# EAGLE design mcat-4cu-b-v2 (EAGLE 6.5.0)

## Sheet 1 of 5
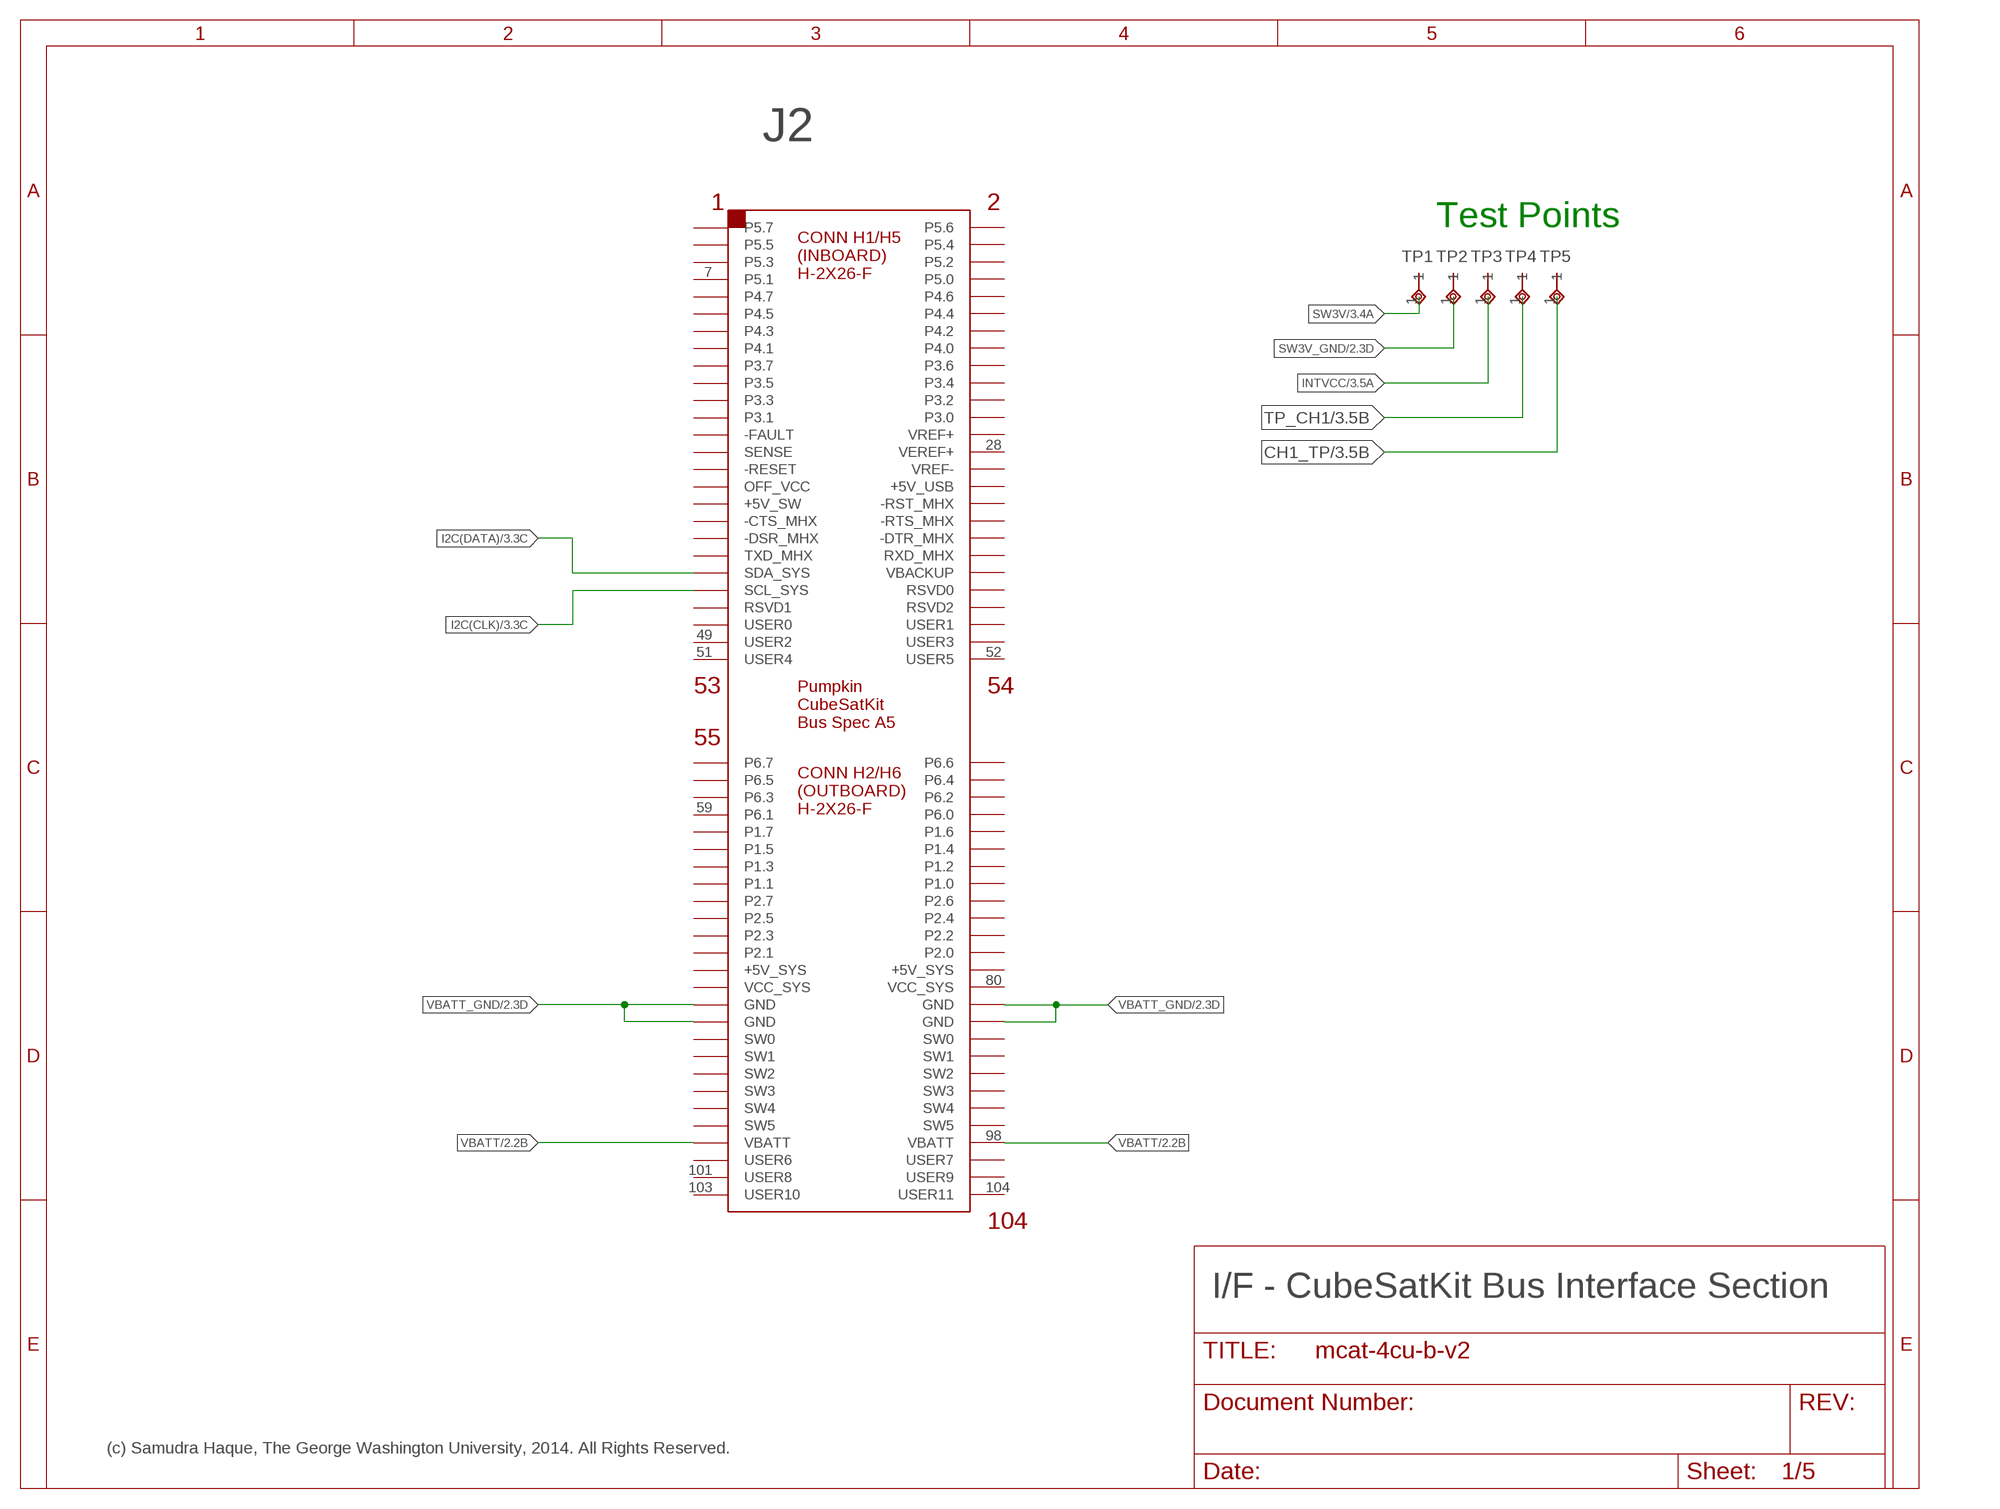
[diagram p0: schematic, sheet 1]

### Parts
J2  CSK-BUS-CONN2X2X26  [CSK-BUS-PKG]
TP1  1P-1508-0-57-15-00-00-03-0  [1P-TP-MILLMAX-11]
TP2  1P-1508-0-57-15-00-00-03-0  [1P-TP-MILLMAX-11]
TP3  1P-1508-0-57-15-00-00-03-0  [1P-TP-MILLMAX-11]
TP4  1P-1508-0-57-15-00-00-03-0  [1P-TP-MILLMAX-11]
TP5  1P-1508-0-57-15-00-00-03-0  [1P-TP-MILLMAX-11]

### Nets
CH1_TP: TP5.1 ; also sheet 3,5
I2C(CLK): J2.43(SCL_SYS) ; also sheet 3
I2C(DATA): J2.41(SDA_SYS) ; also sheet 3
INTVCC: TP3.1 ; also sheet 2,3
SW3V: TP1.1 ; also sheet 3
SW3V_GND: TP2.1 ; also sheet 2,3
TP_CH1: TP4.1 ; also sheet 3
VBATT: J2.97(VBATT) J2.98(VBATT) ; also sheet 2
VBATT_GND: J2.81(GND) J2.82(GND) J2.83(GND) J2.84(GND) ; also sheet 2
Unconnected: J2.1(P5.7) J2.2(P5.6) J2.3(P5.5) J2.4(P5.4) J2.5(P5.3) J2.6(P5.2) J2.7(P5.1) J2.8(P5.0) J2.9(P4.7) J2.10(P4.6) J2.11(P4.5) J2.12(P4.4) J2.13(P4.3) J2.14(P4.2) J2.15(P4.1) J2.16(P4.0) J2.17(P3.7) J2.18(P3.6) J2.19(P3.5) J2.20(P3.4) J2.21(P3.3) J2.22(P3.2) J2.23(P3.1) J2.24(P3.0) J2.25(-FAULT) J2.26(VREF+) J2.27(SENSE) J2.28(VEREF+) J2.29(-RESET) J2.30(VREF-) J2.31(OFF_VCC) J2.32(+5V_USB) J2.33(+5V_SW) J2.34(-RST_MHX) J2.35(-CTS_MHX) J2.36(-RTS_MHX) J2.37(-DSR_MHX) J2.38(-DTR_MHX) J2.39(TXD_MHX) J2.40(RXD_MHX) J2.42(VBACKUP) J2.44(RSVD0) J2.45(RSVD1) J2.46(RSVD2) J2.47(USER0) J2.48(USER1) J2.49(USER2) J2.50(USER3) J2.51(USER4) J2.52(USER5) J2.53(P6.7) J2.54(P6.6) J2.55(P6.5) J2.56(P6.4) J2.57(P6.3) J2.58(P6.2) J2.59(P6.1) J2.60(P6.0) J2.61(P1.7) J2.62(P1.6) J2.63(P1.5) J2.64(P1.4) J2.65(P1.3) J2.66(P1.2) J2.67(P1.1) J2.68(P1.0) J2.69(P2.7) J2.70(P2.6) J2.71(P2.5) J2.72(P2.4) J2.73(P2.3) J2.74(P2.2) J2.75(P2.1) J2.76(P2.0) J2.77(+5V_SYS) J2.78(+5V_SYS) J2.79(VCC_SYS) J2.80(VCC_SYS) J2.85(SW0) J2.86(SW0) J2.87(SW1) J2.88(SW1) J2.89(SW2) J2.90(SW2) J2.91(SW3) J2.92(SW3) J2.93(SW4) J2.94(SW4) J2.95(SW5) J2.96(SW5) J2.99(USER6) J2.100(USER7) J2.101(USER8) J2.102(USER9) J2.103(USER10) J2.104(USER11)

### Notes on the sheet
- Test Points
- I/F - CubeSatKit Bus Interface Section
- (c) Samudra Haque, The George Washington University, 2014. All Rights Reserved.

## Sheet 2 of 5
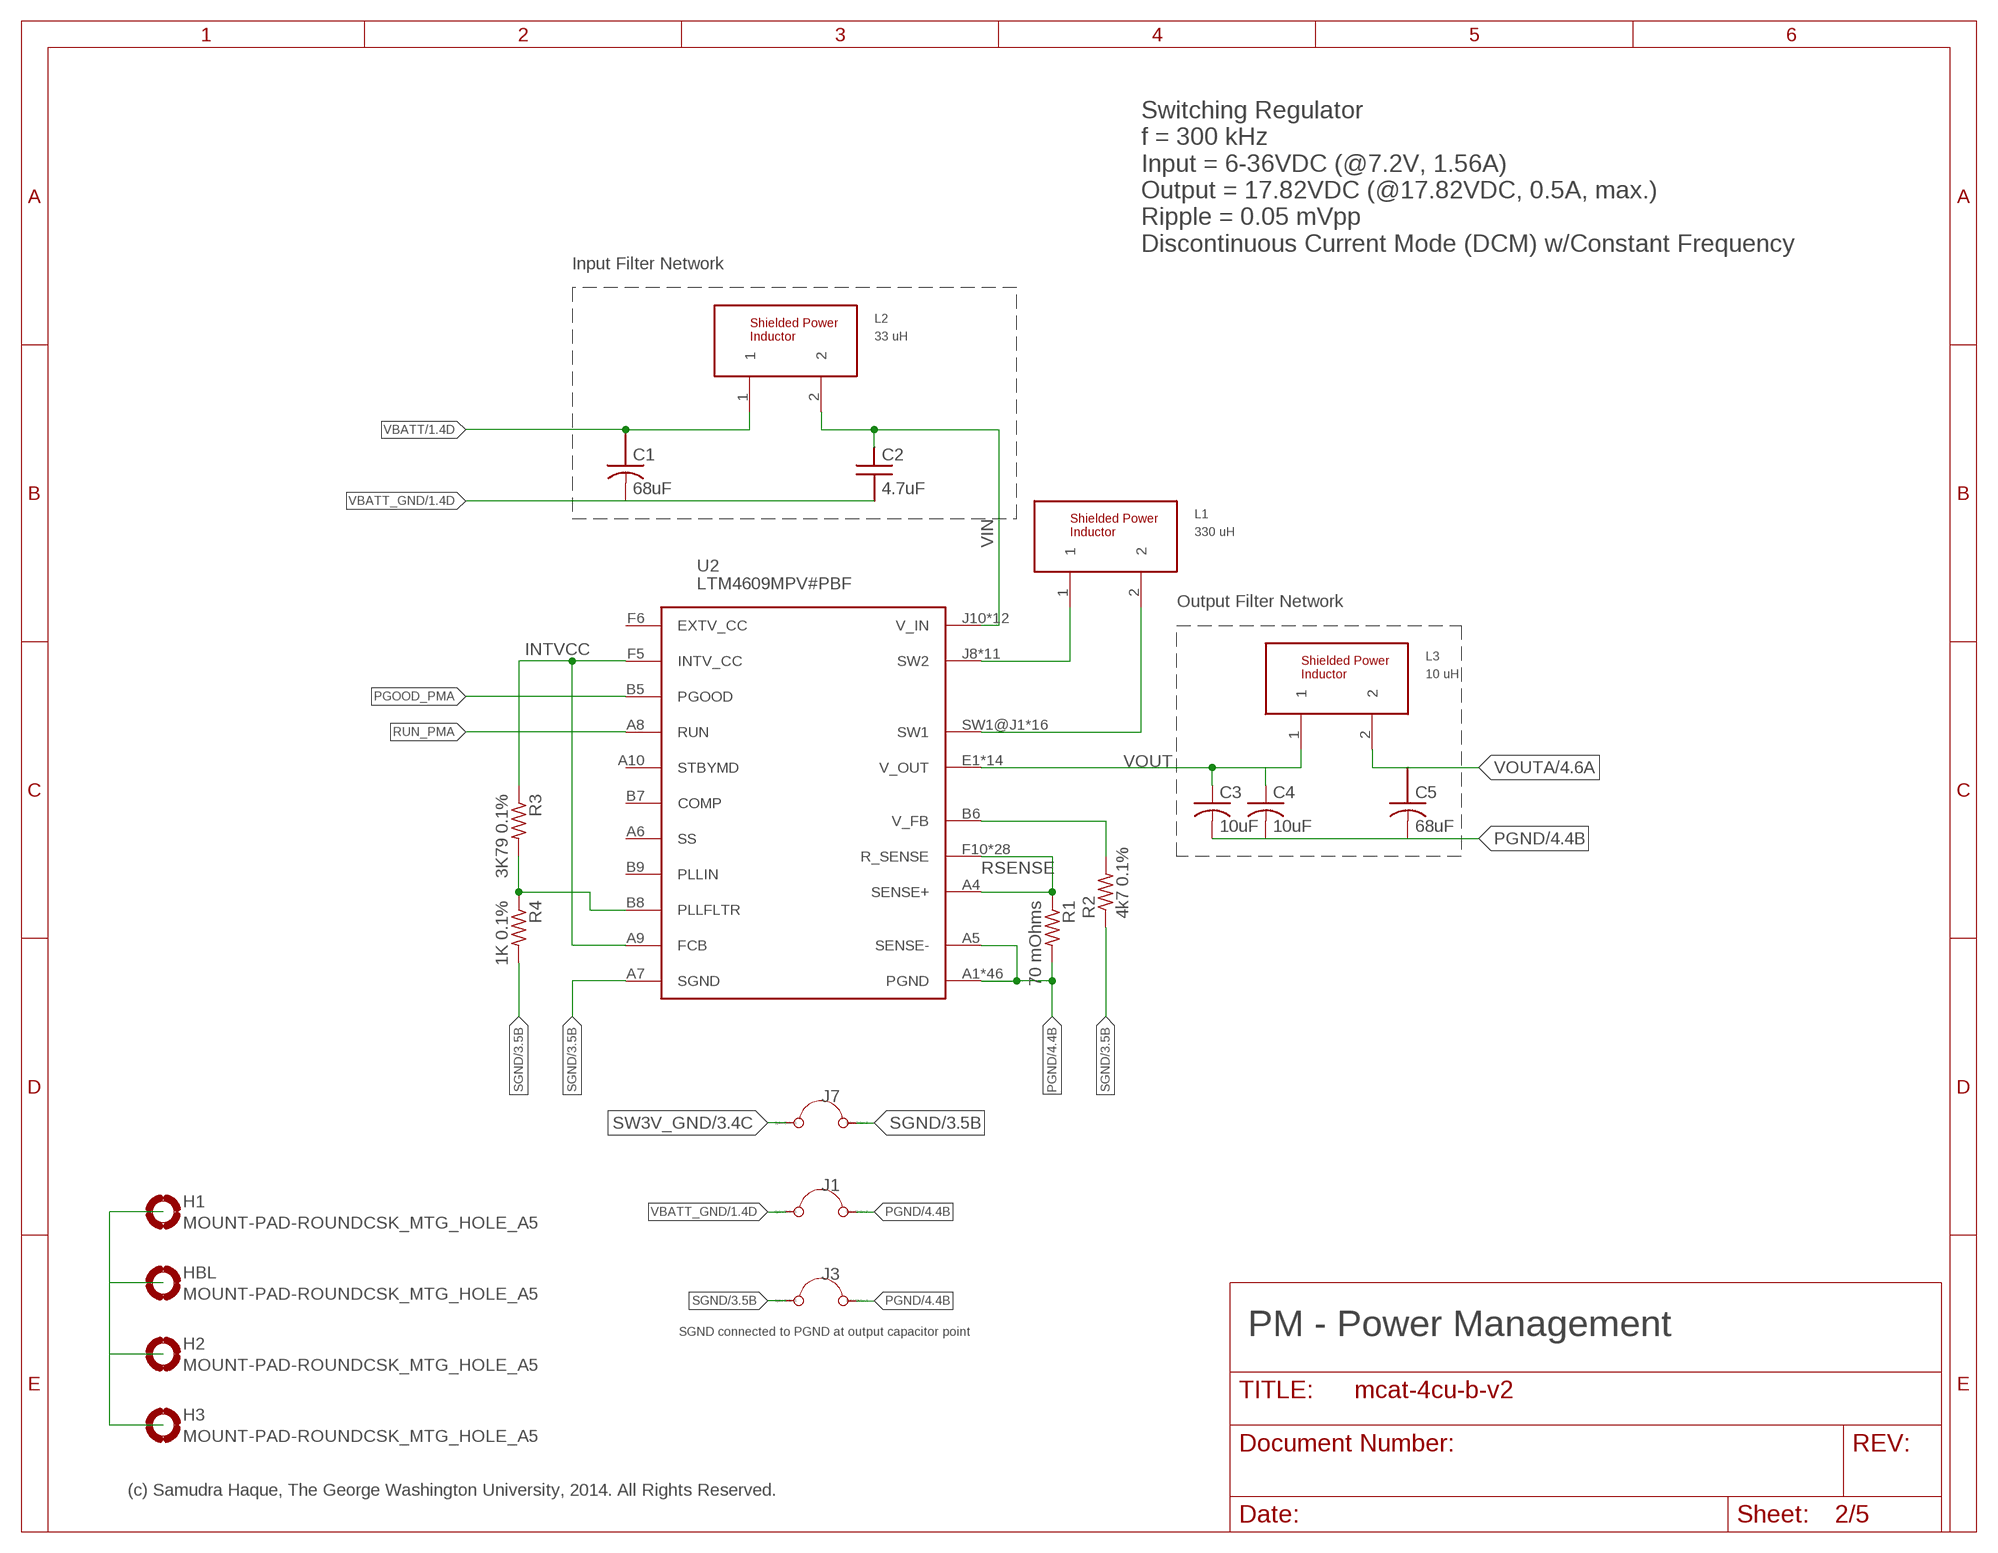
[diagram p1: schematic, sheet 2]

### Parts
C1  68uF  OSCON-50SVPF68M  [OS-CON-SVPF-F12]
C2  4.7uF  AVX-LD105C475KAB2A  [MLCC-X7R-1210]
C3  10uF  C-USC1210K  [C1210K]
C4  10uF  C-USC1210K  [C1210K]
C5  68uF  OSCON-50SVPF68M  [OS-CON-SVPF-F12]
H1  MOUNT-PAD-ROUNDCSK_MTG_HOLE_A5  [CSK_MOUNTING_HOLE]
H2  MOUNT-PAD-ROUNDCSK_MTG_HOLE_A5  [CSK_MOUNTING_HOLE]
H3  MOUNT-PAD-ROUNDCSK_MTG_HOLE_A5  [CSK_MOUNTING_HOLE]
HBL  MOUNT-PAD-ROUNDCSK_MTG_HOLE_A5  [CSK_MOUNTING_HOLE]
J1  JUMPER  [05]
J3  JUMPER  [05]
J7  JUMPER  [05]
L1  330 uH  MSS1048-334KL_  [MSS1048]
L2  33 uH  MSS1038-333ML_  [MSS1048]
L3  10 uH  ELL-5PS100M  [SERIES-POWER-INDUCTORS]
R1  70 mOhms  R-US_R1206  [R1206]
R2  4k7 0.1%  R-US_R0603  [R0603]
R3  3K79 0.1%  R-US_R0805  [R0805]
R4  1K 0.1%  R-US_R0805  [R0805]
U2  LTM4609MPV#PBF  LTM4609MPV#PBFROHS/HITEMP  [LGA-141-LTC-05-08-1840-B]

### Nets
INTVCC: R3.1 U2.A9(FCB) U2.F5(INTV_CC) ; also sheet 1,3
N$8: R2.2 U2.B6(V_FB)
N$21: H1.P$1(MOUNT) H2.P$1(MOUNT) H3.P$1(MOUNT) HBL.P$1(MOUNT)
PGND: C3.2 C4.2 C5.K1(K) J1.2(-) J3.2(-) R1.2 U2.A1(PGND) U2.A2(PGND) U2.A3(PGND) U2.A5(SENSE-) U2.A11(PGND) U2.A12(PGND) U2.B1(PGND) U2.B2(PGND) U2.B3(PGND) U2.B4(PGND) U2.B10(PGND) U2.B11(PGND) U2.B12(PGND) U2.C1(PGND) U2.C2(PGND) U2.C3(PGND) U2.C4(PGND) U2.C5(PGND) U2.C6(PGND) U2.C7(PGND) U2.C8(PGND) U2.C9(PGND) U2.C10(PGND) U2.C11(PGND) U2.C12(PGND) U2.D1(PGND) U2.D2(PGND) U2.D3(PGND) U2.D4(PGND) U2.D5(PGND) U2.D6(PGND) U2.D7(PGND) U2.D8(PGND) U2.D9(PGND) U2.D10(PGND) U2.D11(PGND) U2.D12(PGND) U2.E3(PGND) U2.E4(PGND) U2.E5(PGND) U2.E6(PGND) U2.E7(PGND) U2.E8(PGND) U2.E9(PGND) U2.E10(PGND) U2.E11(PGND) U2.E12(PGND) ; also sheet 4,5
PGOOD_PMA: U2.B5(PGOOD)
RSENSE: R1.1 U2.A4(SENSE+) U2.F10(R_SENSE) U2.F11(R_SENSE) U2.F12(R_SENSE) U2.G5(R_SENSE) U2.G6(R_SENSE) U2.G7(R_SENSE) U2.G8(R_SENSE) U2.G9(R_SENSE) U2.G10(R_SENSE) U2.G11(R_SENSE) U2.G12(R_SENSE) U2.H5(R_SENSE) U2.H6(R_SENSE) U2.H7(R_SENSE) U2.H8(R_SENSE) U2.H9(R_SENSE) U2.H10(R_SENSE) U2.H11(R_SENSE) U2.H12(R_SENSE) U2.J5(R_SENSE) U2.J6(R_SENSE) U2.J7(R_SENSE) U2.K5(R_SENSE) U2.K6(R_SENSE) U2.L5(R_SENSE) U2.L6(R_SENSE) U2.M5(R_SENSE) U2.M6(R_SENSE)
RUN_PMA: U2.A8(RUN)
SETFREQ: R3.2 R4.1 U2.B8(PLLFLTR)
SGND: J3.1(+) J7.2(-) R2.1 R4.2 U2.A7(SGND) ; also sheet 3,4,5
SW1: L1.2 U2.SW1@J1(SW1) U2.SW1@J2(SW1) U2.SW1@J3(SW1) U2.SW1@J4(SW1) U2.SW1@K1(SW1) U2.SW1@K2(SW1) U2.SW1@K3(SW1) U2.SW1@K4(SW1) U2.SW1@L1(SW1) U2.SW1@L2(SW1) U2.SW1@L3(SW1) U2.SW1@L4(SW1) U2.SW1@M1(SW1) U2.SW1@M2(SW1) U2.SW1@M3(SW1) U2.SW1@M4(SW1)
SW2: L1.1 U2.J8(SW2) U2.J9(SW2) U2.K7(SW2) U2.K8(SW2) U2.K9(SW2) U2.L7(SW2) U2.L8(SW2) U2.L9(SW2) U2.M7(SW2) U2.M8(SW2) U2.M9(SW2)
SW3V_GND: J7.1(+) ; also sheet 1,3
VBATT: C1.A1(A) L2.1 ; also sheet 1
VBATT_GND: C1.K1(K) C2.2 J1.1(+) ; also sheet 1
VIN: C2.1 L2.2 U2.J10(V_IN) U2.J11(V_IN) U2.J12(V_IN) U2.K10(V_IN) U2.K11(V_IN) U2.K12(V_IN) U2.L10(V_IN) U2.L11(V_IN) U2.L12(V_IN) U2.M10(V_IN) U2.M11(V_IN) U2.M12(V_IN)
VOUT: C3.1 C4.1 L3.1 U2.E1(V_OUT) U2.E2(V_OUT) U2.F1(V_OUT) U2.F2(V_OUT) U2.F3(V_OUT) U2.F4(V_OUT) U2.G1(V_OUT) U2.G2(V_OUT) U2.G3(V_OUT) U2.G4(V_OUT) U2.H2(V_OUT) U2.H3(V_OUT) U2.H4(V_OUT) U2.VOUT(V_OUT)
VOUTA: C5.A1(A) L3.2 ; also sheet 4
Unconnected: U2.A6(SS) U2.A10(STBYMD) U2.B7(COMP) U2.B9(PLLIN) U2.F6(EXTV_CC)

### Notes on the sheet
- Switching Regulator
  f = 300 kHz
  Input = 6-36VDC (@7.2V, 1.56A)
  Output = 17.82VDC (@17.82VDC, 0.5A, max.)
  Ripple = 0.05 mVpp
  Discontinuous Current Mode (DCM) w/Constant Frequency
- Input Filter Network
- Output Filter Network
- SGND connected to PGND at output capacitor point | PM - Power Management
- (c) Samudra Haque, The George Washington University, 2014. All Rights Reserved.

## Sheet 3 of 5
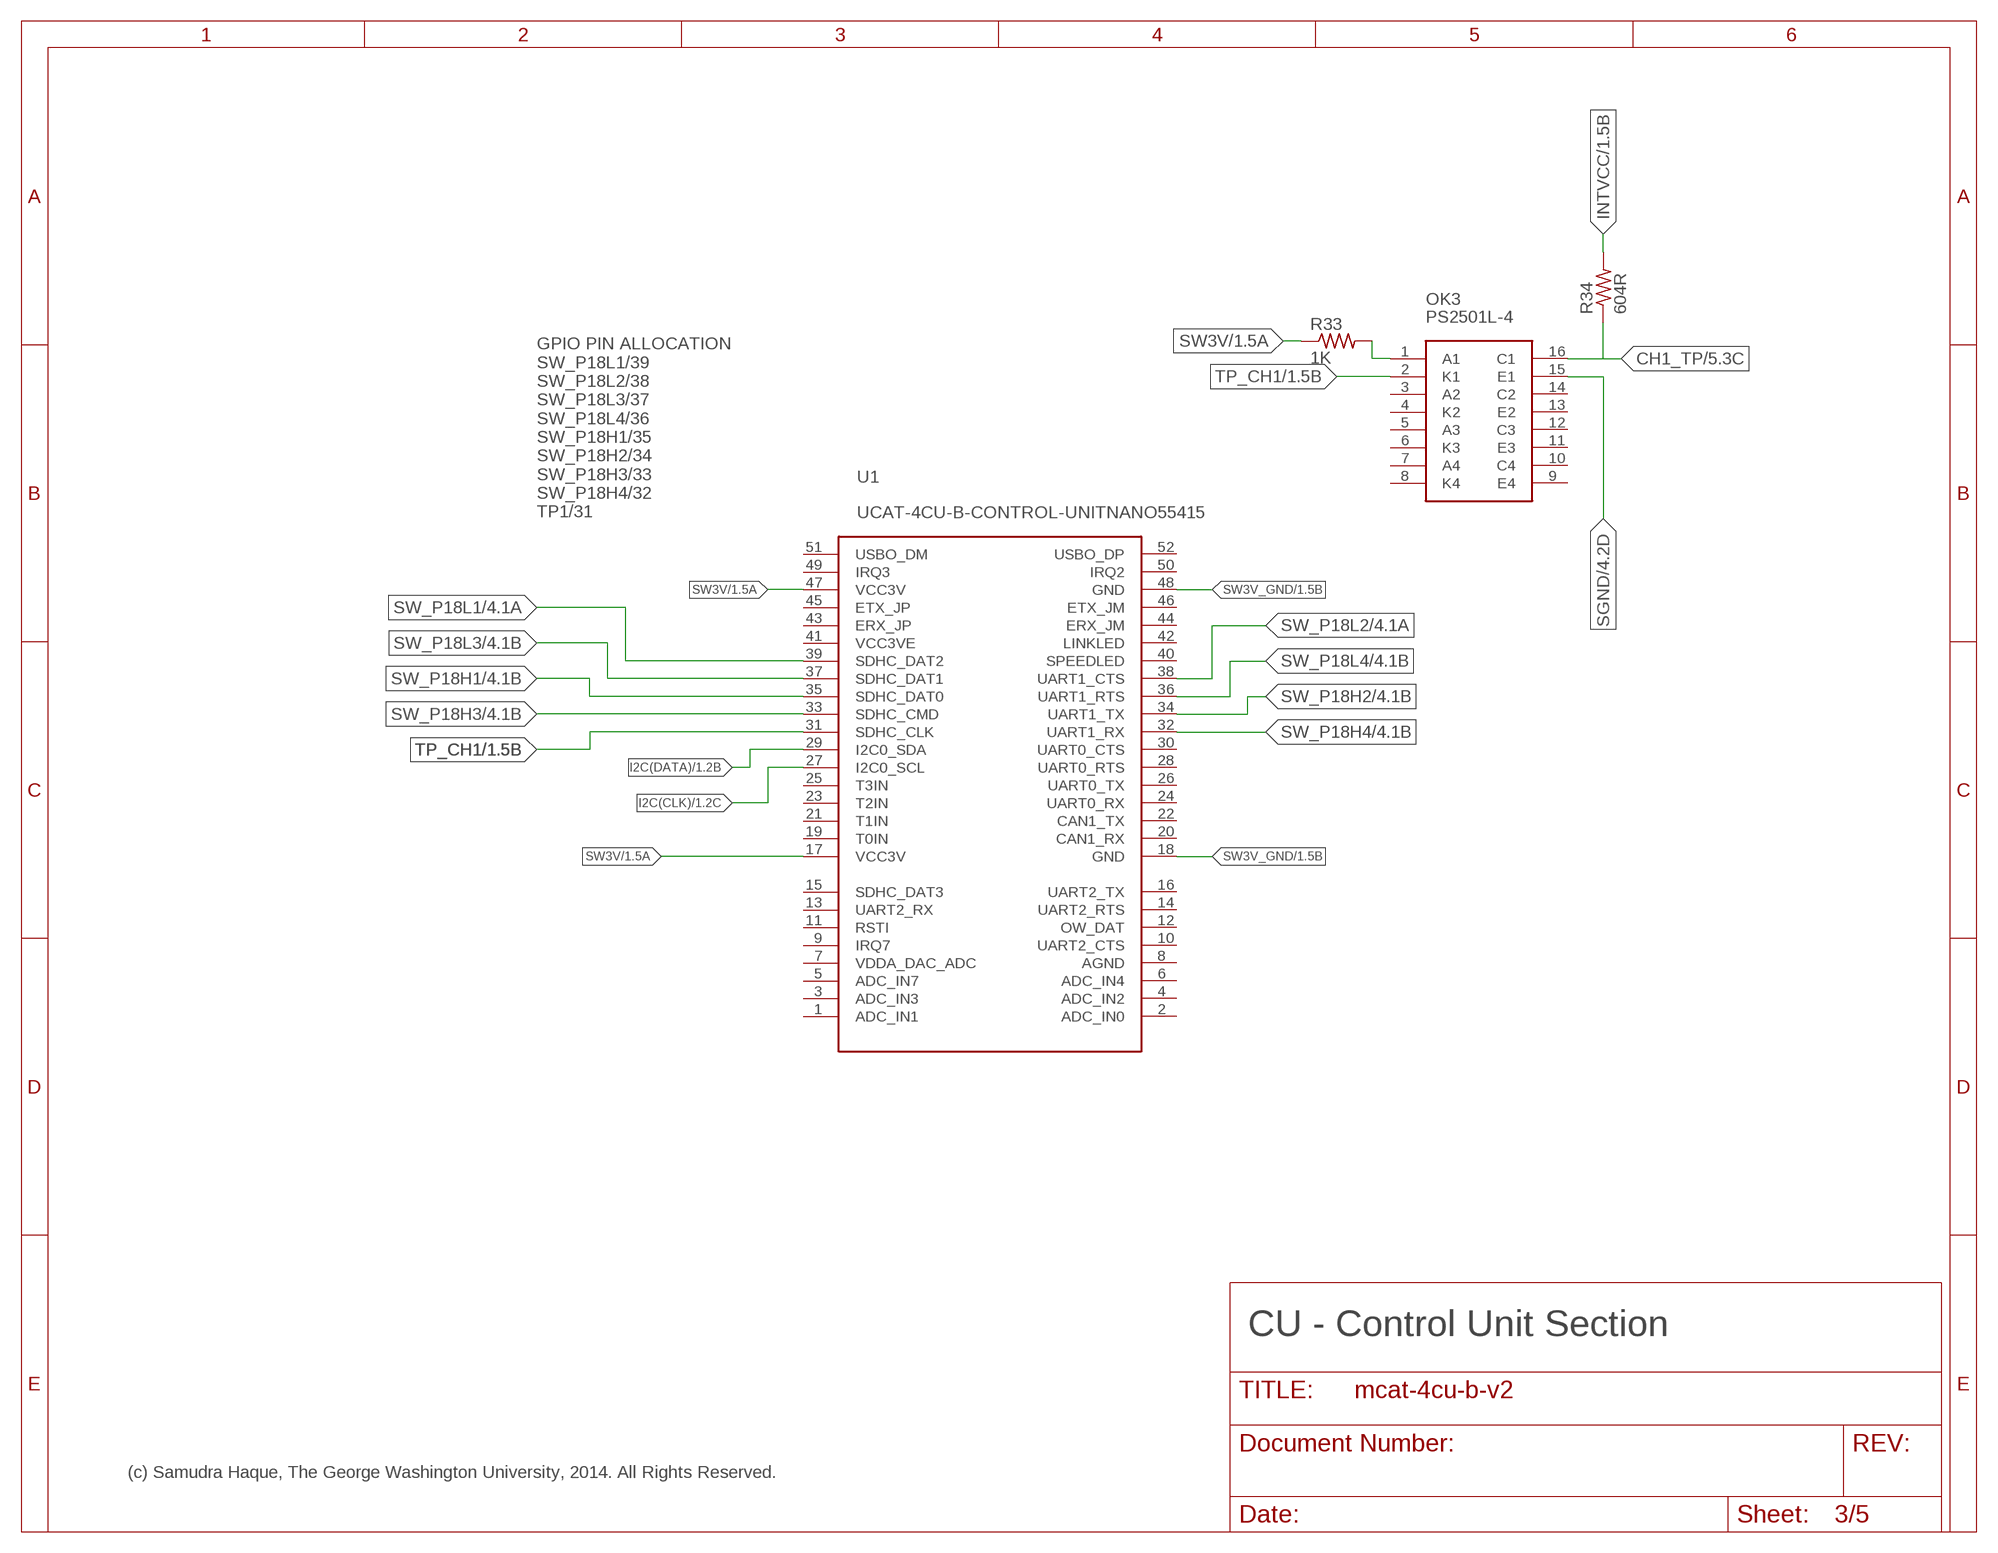
[diagram p2: schematic, sheet 3]

### Parts
OK3  PS2501L-4  [PS2501L-4]
R33  1K  R-US_R0805  [R0805]
R34  604R  R-US_R0805  [R0805]
U1  UCAT-4CU-B-CONTROL-UNITNANO55415  [MOLEX-MINI-PCI-EXPRESS-8MM-52CKT]

### Nets
CH1_TP: OK3.16(C1) R34.1 ; also sheet 1,5
I2C(CLK): U1.27(I2C0_SCL) ; also sheet 1
I2C(DATA): U1.29(I2C0_SDA) ; also sheet 1
INTVCC: R34.2 ; also sheet 1,2
N$3: U1.18(GND)
N$16: OK3.1(A1) R33.2
SGND: OK3.15(E1) ; also sheet 2,4,5
SW3V: R33.1 U1.17(VCC3V) U1.47(VCC3V) ; also sheet 1
SW3V_GND: U1.48(GND) ; also sheet 1,2
SW_P18H1: U1.35(SDHC_DAT0) ; also sheet 4
SW_P18H2: U1.34(UART1_TX) ; also sheet 4
SW_P18H3: U1.33(SDHC_CMD) ; also sheet 4
SW_P18H4: U1.32(UART1_RX) ; also sheet 4
SW_P18L1: U1.39(SDHC_DAT2) ; also sheet 4
SW_P18L2: U1.38(UART1_CTS) ; also sheet 4
SW_P18L3: U1.37(SDHC_DAT1) ; also sheet 4
SW_P18L4: U1.36(UART1_RTS) ; also sheet 4
TP_CH1: OK3.2(K1) U1.31(SDHC_CLK) ; also sheet 1
Unconnected: OK3.3(A2) OK3.4(K2) OK3.5(A3) OK3.6(K3) OK3.7(A4) OK3.8(K4) OK3.9(E4) OK3.10(C4) OK3.11(E3) OK3.12(C3) OK3.13(E2) OK3.14(C2) U1.1(ADC_IN1) U1.2(ADC_IN0) U1.3(ADC_IN3) U1.4(ADC_IN2) U1.5(ADC_IN7) U1.6(ADC_IN4) U1.7(VDDA_DAC_ADC) U1.8(AGND) U1.9(IRQ7) U1.10(UART2_CTS) U1.11(RSTI) U1.12(OW_DAT) U1.13(UART2_RX) U1.14(UART2_RTS) U1.15(SDHC_DAT3) U1.16(UART2_TX) U1.19(T0IN) U1.20(CAN1_RX) U1.21(T1IN) U1.22(CAN1_TX) U1.23(T2IN) U1.24(UART0_RX) U1.25(T3IN) U1.26(UART0_TX) U1.28(UART0_RTS) U1.30(UART0_CTS) U1.40(SPEEDLED) U1.41(VCC3VE) U1.42(LINKLED) U1.43(ERX_JP) U1.44(ERX_JM) U1.45(ETX_JP) U1.46(ETX_JM) U1.49(IRQ3) U1.50(IRQ2) U1.51(USBO_DM) U1.52(USBO_DP)

### Notes on the sheet
- GPIO PIN ALLOCATION
  SW_P18L1/39
  SW_P18L2/38
  SW_P18L3/37
  SW_P18L4/36
  SW_P18H1/35
  SW_P18H2/34
  SW_P18H3/33
  SW_P18H4/32
  TP1/31
- CU - Control Unit Section
- (c) Samudra Haque, The George Washington University, 2014. All Rights Reserved.

## Sheet 4 of 5
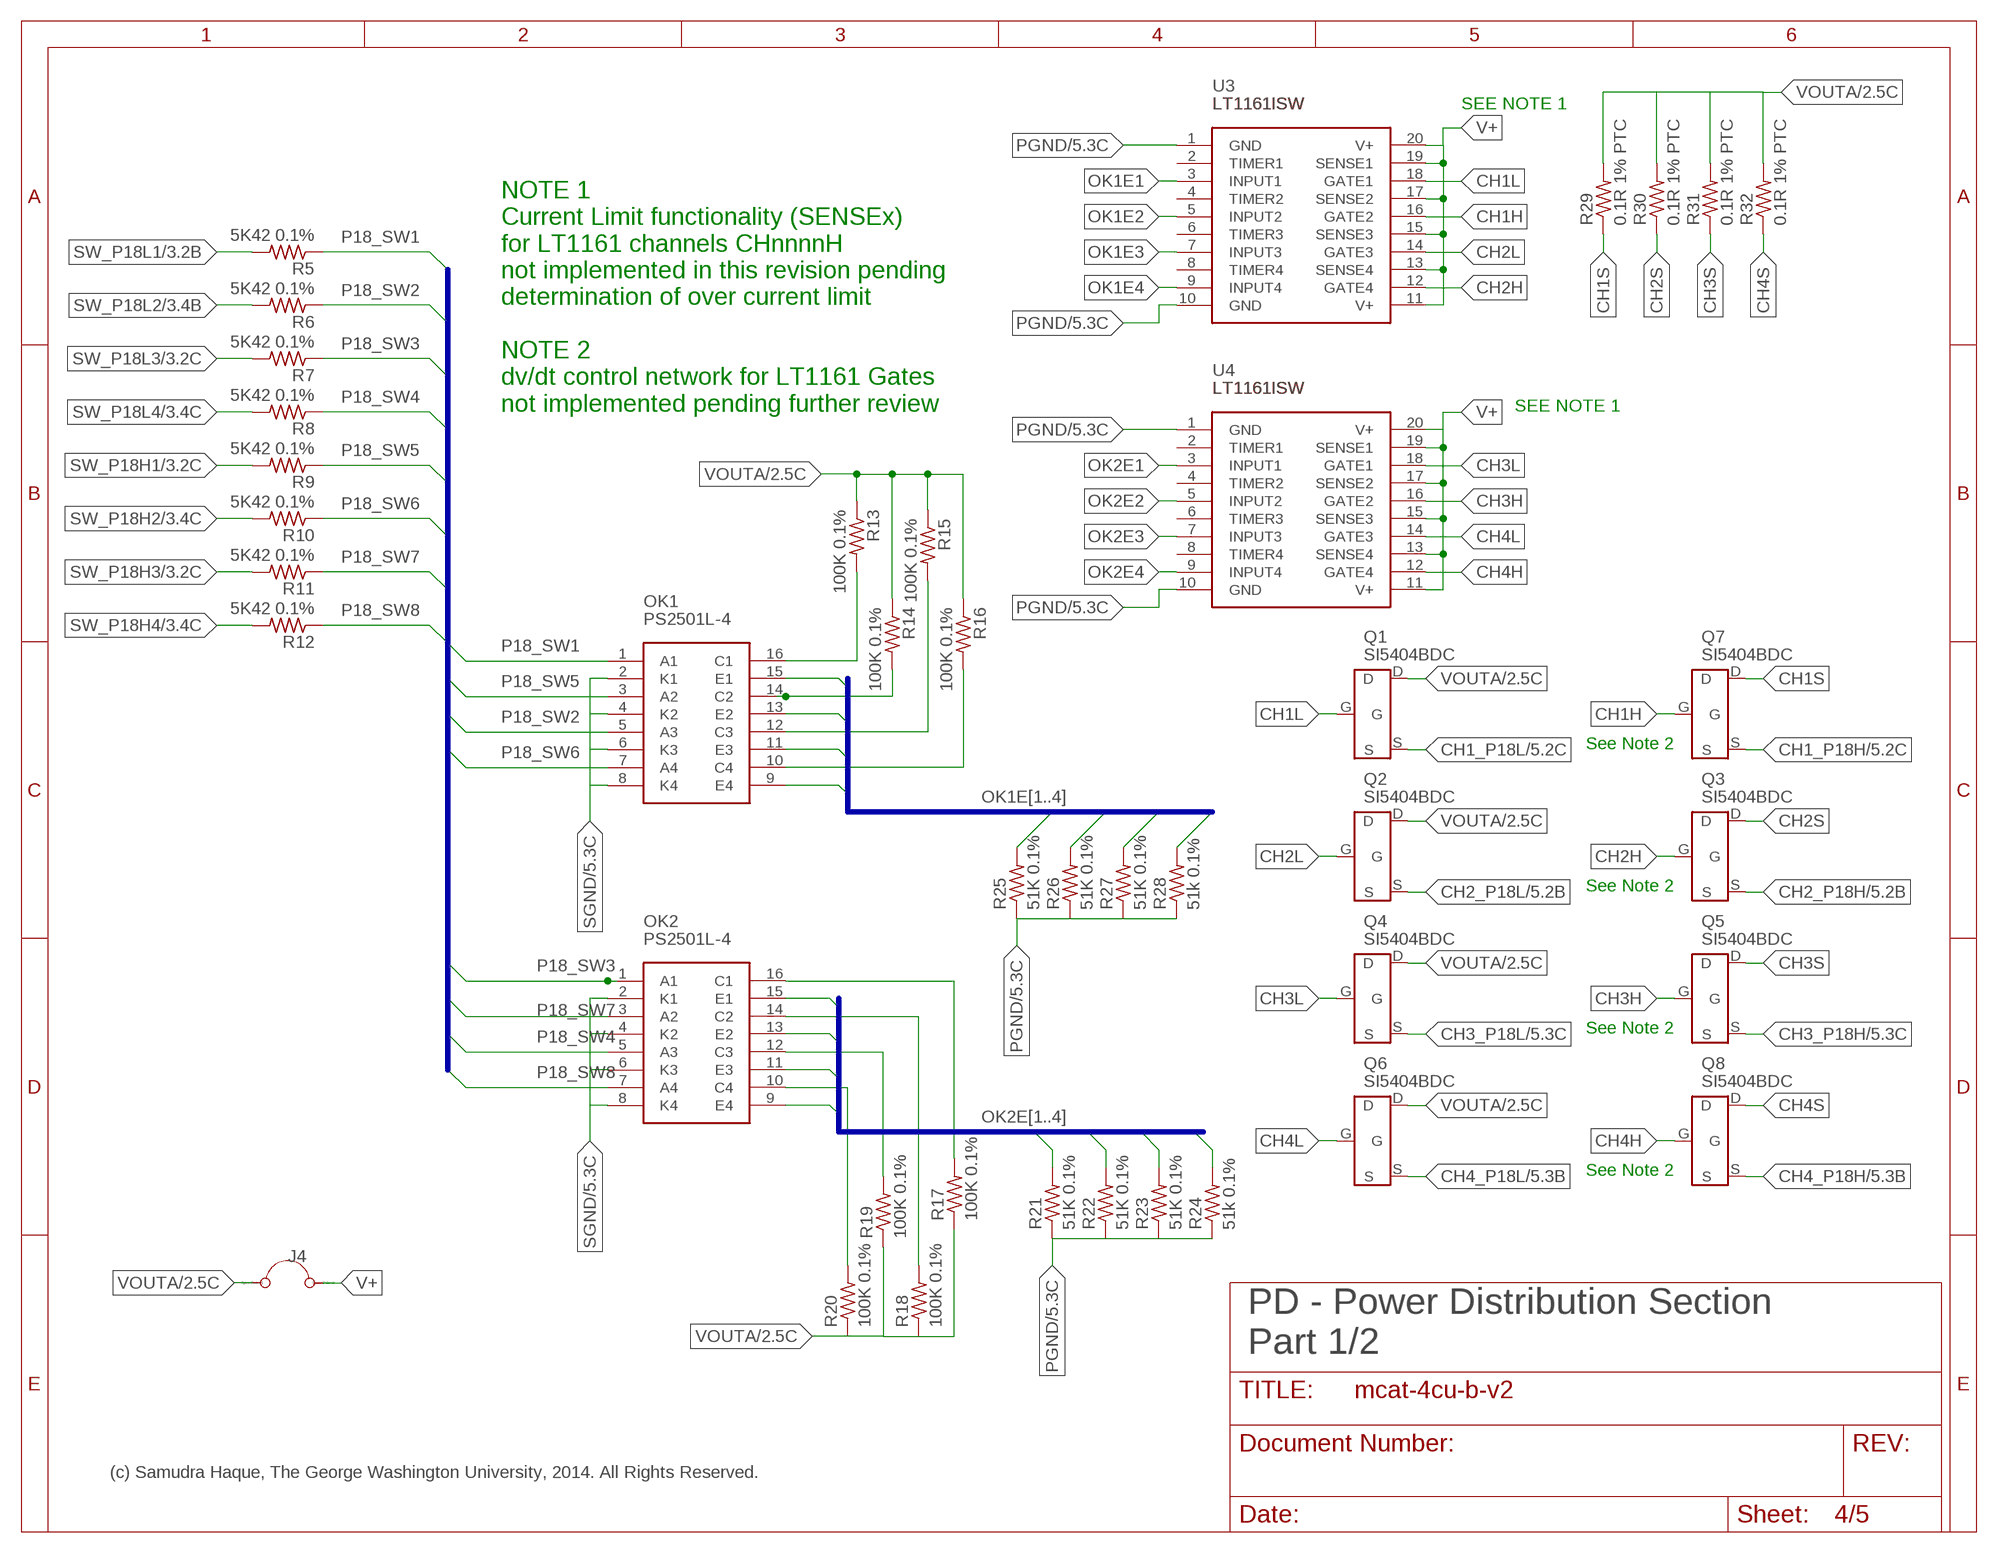
[diagram p3: schematic, sheet 4]

### Parts
J4  JUMPER  [05]
OK1  PS2501L-4  [PS2501L-4]
OK2  PS2501L-4  [PS2501L-4]
Q1  SI5404BDC  [1206-8-CHIPFET]
Q2  SI5404BDC  [1206-8-CHIPFET]
Q3  SI5404BDC  [1206-8-CHIPFET]
Q4  SI5404BDC  [1206-8-CHIPFET]
Q5  SI5404BDC  [1206-8-CHIPFET]
Q6  SI5404BDC  [1206-8-CHIPFET]
Q7  SI5404BDC  [1206-8-CHIPFET]
Q8  SI5404BDC  [1206-8-CHIPFET]
R5  5K42 0.1%  R-US_R1206  [R1206]
R6  5K42 0.1%  R-US_R1206  [R1206]
R7  5K42 0.1%  R-US_R1206  [R1206]
R8  5K42 0.1%  R-US_R1206  [R1206]
R9  5K42 0.1%  R-US_R1206  [R1206]
R10  5K42 0.1%  R-US_R1206  [R1206]
R11  5K42 0.1%  R-US_R1206  [R1206]
R12  5K42 0.1%  R-US_R1206  [R1206]
R13  100K 0.1%  R-US_R0402  [R0402]
R14  100K 0.1%  R-US_R0402  [R0402]
R15  100K 0.1%  R-US_R0402  [R0402]
R16  100K 0.1%  R-US_R0402  [R0402]
R17  100K 0.1%  R-US_R0402  [R0402]
R18  100K 0.1%  R-US_R0402  [R0402]
R19  100K 0.1%  R-US_R0402  [R0402]
R20  100K 0.1%  R-US_R0402  [R0402]
R21  51K 0.1%  R-US_R0603  [R0603]
R22  51K 0.1%  R-US_R0603  [R0603]
R23  51K 0.1%  R-US_R0603  [R0603]
R24  51k 0.1%  R-US_R0603  [R0603]
R25  51K 0.1%  R-US_R0603  [R0603]
R26  51K 0.1%  R-US_R0603  [R0603]
R27  51K 0.1%  R-US_R0603  [R0603]
R28  51k 0.1%  R-US_R0603  [R0603]
R29  0.1R 1% PTC  R-US_R0402  [R0402]
R30  0.1R 1% PTC  R-US_R0402  [R0402]
R31  0.1R 1% PTC  R-US_R0402  [R0402]
R32  0.1R 1% PTC  R-US_R0402  [R0402]
U3  LT1161ISW  [20-LEAD-PLASTIC-SO]
U4  LT1161ISW  [20-LEAD-PLASTIC-SO]

### Nets
CH1_P18H: Q7.S ; also sheet 5
CH1_P18L: Q1.S ; also sheet 5
CH1H: Q7.G U3.16(GATE2)
CH1L: Q1.G U3.18(GATE1)
CH1S: Q7.D R29.1
CH2_P18H: Q3.S ; also sheet 5
CH2_P18L: Q2.S ; also sheet 5
CH2H: Q3.G U3.12(GATE4)
CH2L: Q2.G U3.14(GATE3)
CH2S: Q3.D R30.1
CH3_P18H: Q5.S ; also sheet 5
CH3_P18L: Q4.S ; also sheet 5
CH3H: Q5.G U4.16(GATE2)
CH3L: Q4.G U4.18(GATE1)
CH3S: Q5.D R31.1
CH4_P18H: Q8.S ; also sheet 5
CH4_P18L: Q6.S ; also sheet 5
CH4H: Q8.G U4.12(GATE4)
CH4L: Q6.G U4.14(GATE3)
CH4S: Q8.D R32.1
N$4: OK1.16(C1) R13.2
N$5: OK1.14(C2) R14.2
N$7: OK1.12(C3) R15.2
N$9: OK1.10(C4) R16.2
N$10: OK2.16(C1) R17.2
N$11: OK2.14(C2) R18.2
N$12: OK2.12(C3) R19.2
N$13: OK2.10(C4) R20.2
OK1E1: OK1.15(E1) R25.2 U3.3(INPUT1)
OK1E2: OK1.13(E2) R26.2 U3.5(INPUT2)
OK1E3: OK1.11(E3) R27.2 U3.7(INPUT3)
OK1E4: OK1.9(E4) R28.2 U3.9(INPUT4)
OK2E1: OK2.15(E1) R21.2 U4.3(INPUT1)
OK2E2: OK2.13(E2) R22.2 U4.5(INPUT2)
OK2E3: OK2.11(E3) R23.2 U4.7(INPUT3)
OK2E4: OK2.9(E4) R24.2 U4.9(INPUT4)
P18_SW1: OK1.1(A1) R5.1
P18_SW2: OK1.5(A3) R6.1
P18_SW3: OK2.1(A1) R7.1
P18_SW4: OK2.5(A3) R8.1
P18_SW5: OK1.3(A2) R9.1
P18_SW6: OK1.7(A4) R10.1
P18_SW7: OK2.3(A2) R11.1
P18_SW8: OK2.7(A4) R12.1
PGND: R21.1 R22.1 R23.1 R24.1 R25.1 R26.1 R27.1 R28.1 U3.1(GND) U3.10(GND) U4.1(GND) U4.10(GND) ; also sheet 2,5
SGND: OK1.2(K1) OK1.4(K2) OK1.6(K3) OK1.8(K4) OK2.2(K1) OK2.4(K2) OK2.6(K3) OK2.8(K4) ; also sheet 2,3,5
SW_P18H1: R9.2 ; also sheet 3
SW_P18H2: R10.2 ; also sheet 3
SW_P18H3: R11.2 ; also sheet 3
SW_P18H4: R12.2 ; also sheet 3
SW_P18L1: R5.2 ; also sheet 3
SW_P18L2: R6.2 ; also sheet 3
SW_P18L3: R7.2 ; also sheet 3
SW_P18L4: R8.2 ; also sheet 3
V+: J4.2(-) U3.11(V+) U3.13(SENSE4) U3.15(SENSE3) U3.17(SENSE2) U3.19(SENSE1) U3.20(V+) U4.11(V+) U4.13(SENSE4) U4.15(SENSE3) U4.17(SENSE2) U4.19(SENSE1) U4.20(V+)
VOUTA: J4.1(+) Q1.D Q2.D Q4.D Q6.D R13.1 R14.1 R15.1 R16.1 R17.1 R18.1 R19.1 R20.1 R29.2 R30.2 R31.2 R32.2 ; also sheet 2
Unconnected: U3.2(TIMER1) U3.4(TIMER2) U3.6(TIMER3) U3.8(TIMER4) U4.2(TIMER1) U4.4(TIMER2) U4.6(TIMER3) U4.8(TIMER4)

### Buses
P18_SW[1..8]
OK1E[1..4]
OK2E[1..4]

### Notes on the sheet
- SEE NOTE 1
- NOTE 1 
  Current Limit functionality (SENSEx)
  for LT1161 channels CHnnnnH
  not implemented in this revision pending
  determination of over current limit
  
  NOTE 2
  dv/dt control network for LT1161 Gates
  not implemented pending further review
- SEE NOTE 1
- See Note 2
- See Note 2
- See Note 2
- See Note 2
- PD - Power Distribution Section
  Part 1/2
- (c) Samudra Haque, The George Washington University, 2014. All Rights Reserved.

## Sheet 5 of 5
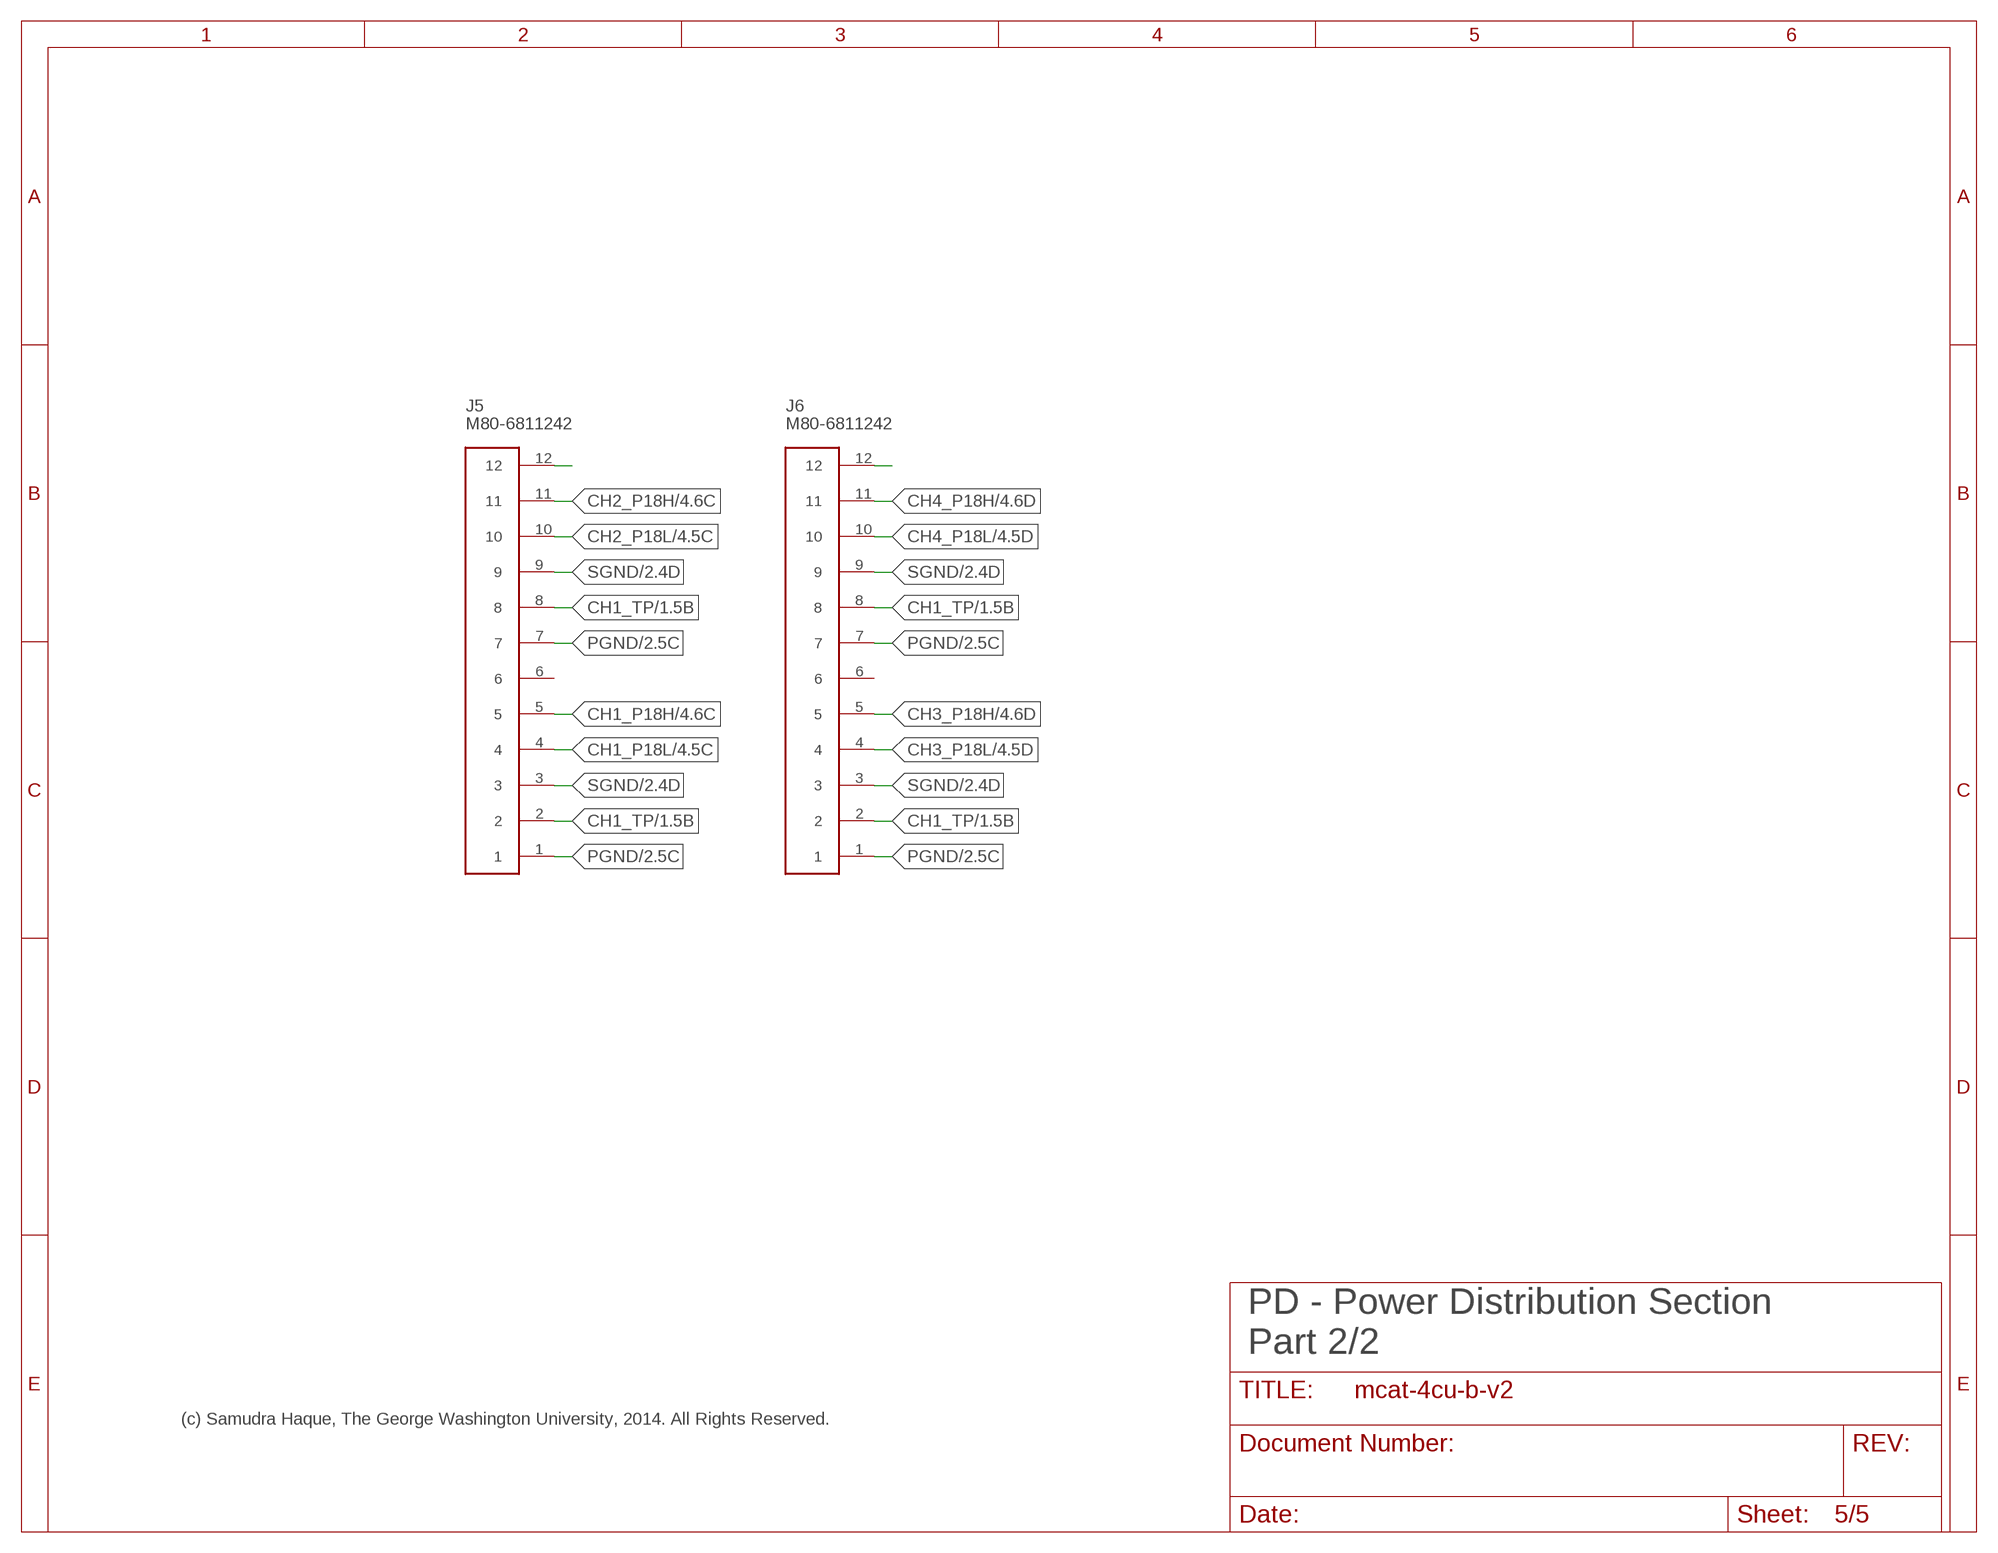
[diagram p4: schematic, sheet 5]

### Parts
J5  M80-6811242  [M80-68112]
J6  M80-6811242  [M80-68112]

### Nets
CH1_P18H: J5.5 ; also sheet 4
CH1_P18L: J5.4 ; also sheet 4
CH1_TP: J5.2 J5.8 J6.2 J6.8 ; also sheet 1,3
CH2_P18H: J5.11 ; also sheet 4
CH2_P18L: J5.10 ; also sheet 4
CH3_P18H: J6.5 ; also sheet 4
CH3_P18L: J6.4 ; also sheet 4
CH4_P18H: J6.11 ; also sheet 4
CH4_P18L: J6.10 ; also sheet 4
N$14: J6.12
N$19: J5.12
PGND: J5.1 J5.7 J6.1 J6.7 ; also sheet 2,4
SGND: J5.3 J5.9 J6.3 J6.9 ; also sheet 2,3,4
Unconnected: J5.6 J6.6

### Notes on the sheet
- PD - Power Distribution Section
  Part 2/2
- (c) Samudra Haque, The George Washington University, 2014. All Rights Reserved.

## Library data of the parts
C1 C5 = gwu_mpnl_ucat_v8:OSCON-50SVPF
C2 = gwu_mpnl_ucat_v8:AVX-LD105C475KAB2A
C3 C4 = rcl:C-US: CAPACITOR, American symbol
H1-H3 HBL = mpnl_holes:MOUNT-PAD-ROUND: MOUNTING PAD, round
J1 J3 J4 J7 = Misc:JUMPER: A wire jumper. This component lets you give the same net two different names
J2 = gwu_mpnl_ucat_v8:CSK-BUS-CONN: Cubesat Kit Bus Connector 2 x Samtec ESQ-126-39-G-D Connectors 104 pins per Cubesat Kit Bus Spec A5
J5 J6 = gwu_mpnl_ucat_v8:M80-6811242
L1 = gwu_mpnl_ucat_v8:MSS1048
L2 = gwu_mpnl_ucat_v8:MSS1038
L3 = gwu_mpnl_ucat_v8:ELL-5PS100M; MF: PANASONIC; MPN: ELL5PS100M; OC_FARNELL: 1717452
OK1-OK3 = gwu_mpnl_ucat_v8:PS2501L-4
Q1-Q8 = gwu_mpnl_ucat_v8:SI5404BDC
R1 R2 R5-R28 R33 R34 = resistor:R-US_: RESISTOR, American symbol
R3 R4 R29-R32 = rcl:R-US_: RESISTOR, American symbol
TP1-TP5 = gwu_mpnl_ucat_v8:1P-1508-0-57-15-00-00-03-0
U1 = gwu_mpnl_ucat_v8:UCAT-4CU-B-CONTROL-UNIT
U2 = gwu_mpnl_ucat_v8:LTM4609MPV#PBF: Per LTC Datasheet 4609fe LTM4609 (c) Samudra Haque, N3RDX, 2/23/2014
U3 U4 = gwu_mpnl_ucat_v8:LT1161

## Net classes
0 default: clearance 0.205 mm

## Board
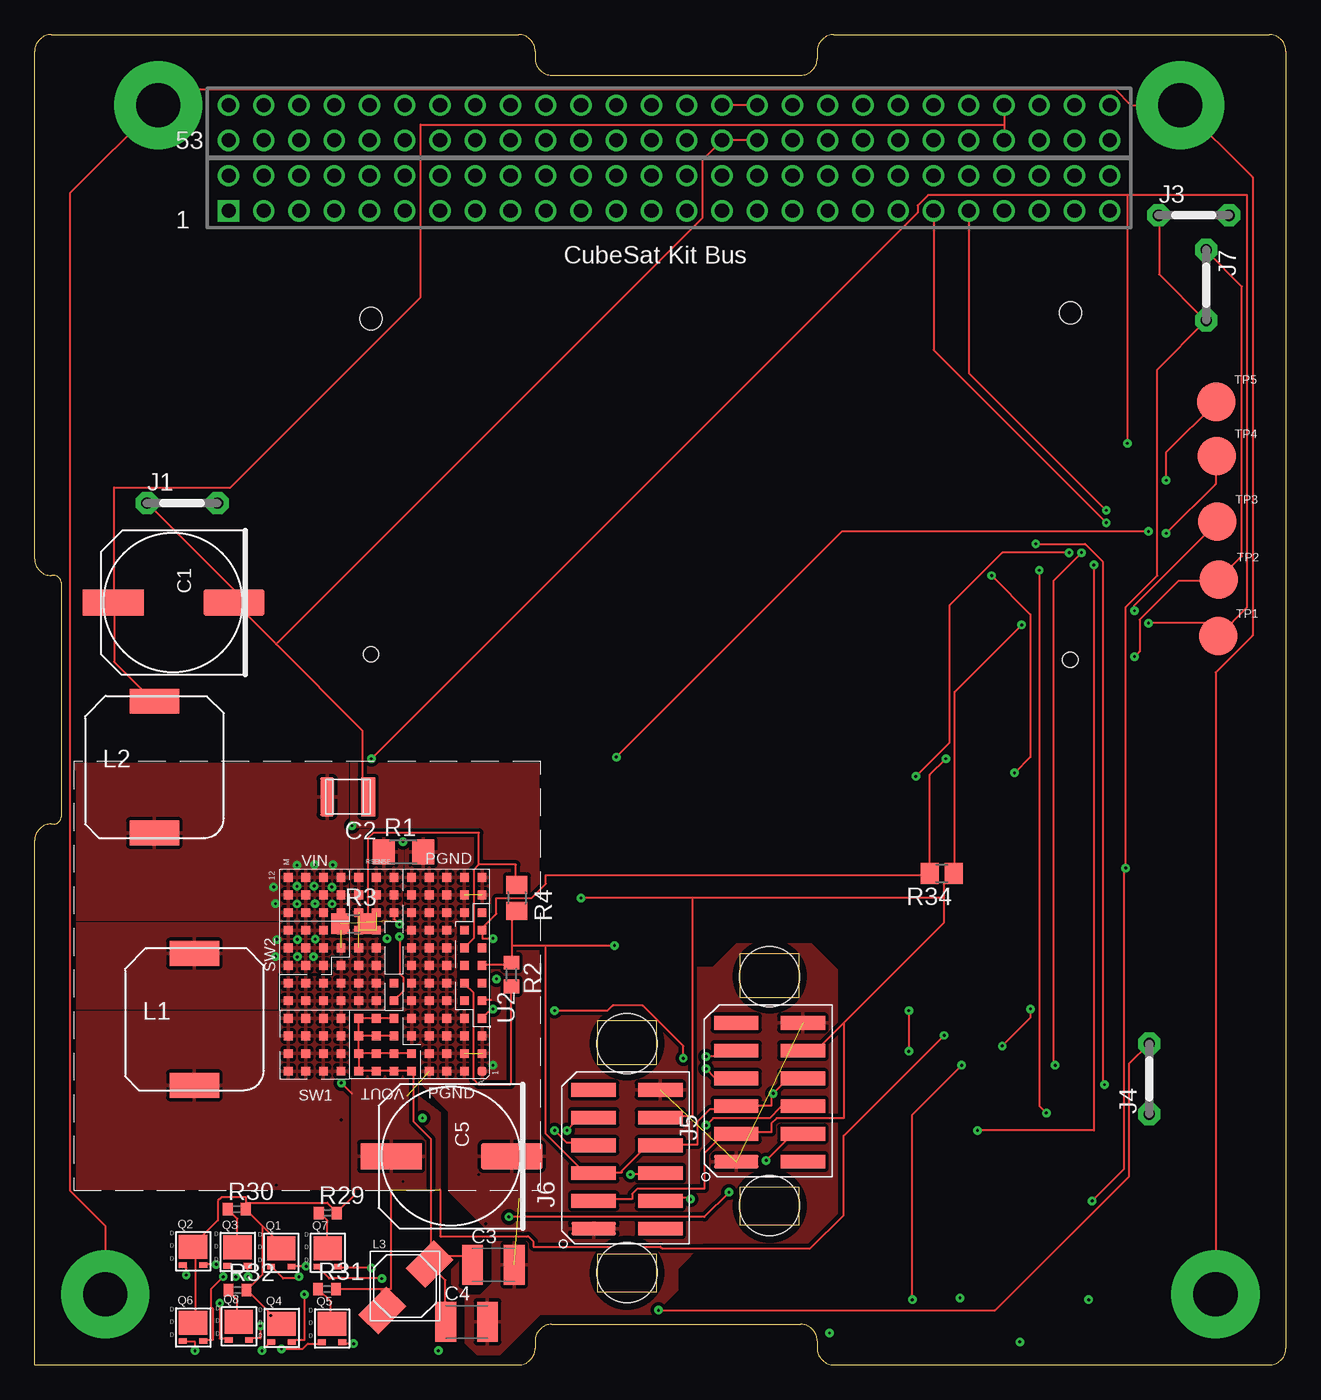
[diagram p5: board, top side]
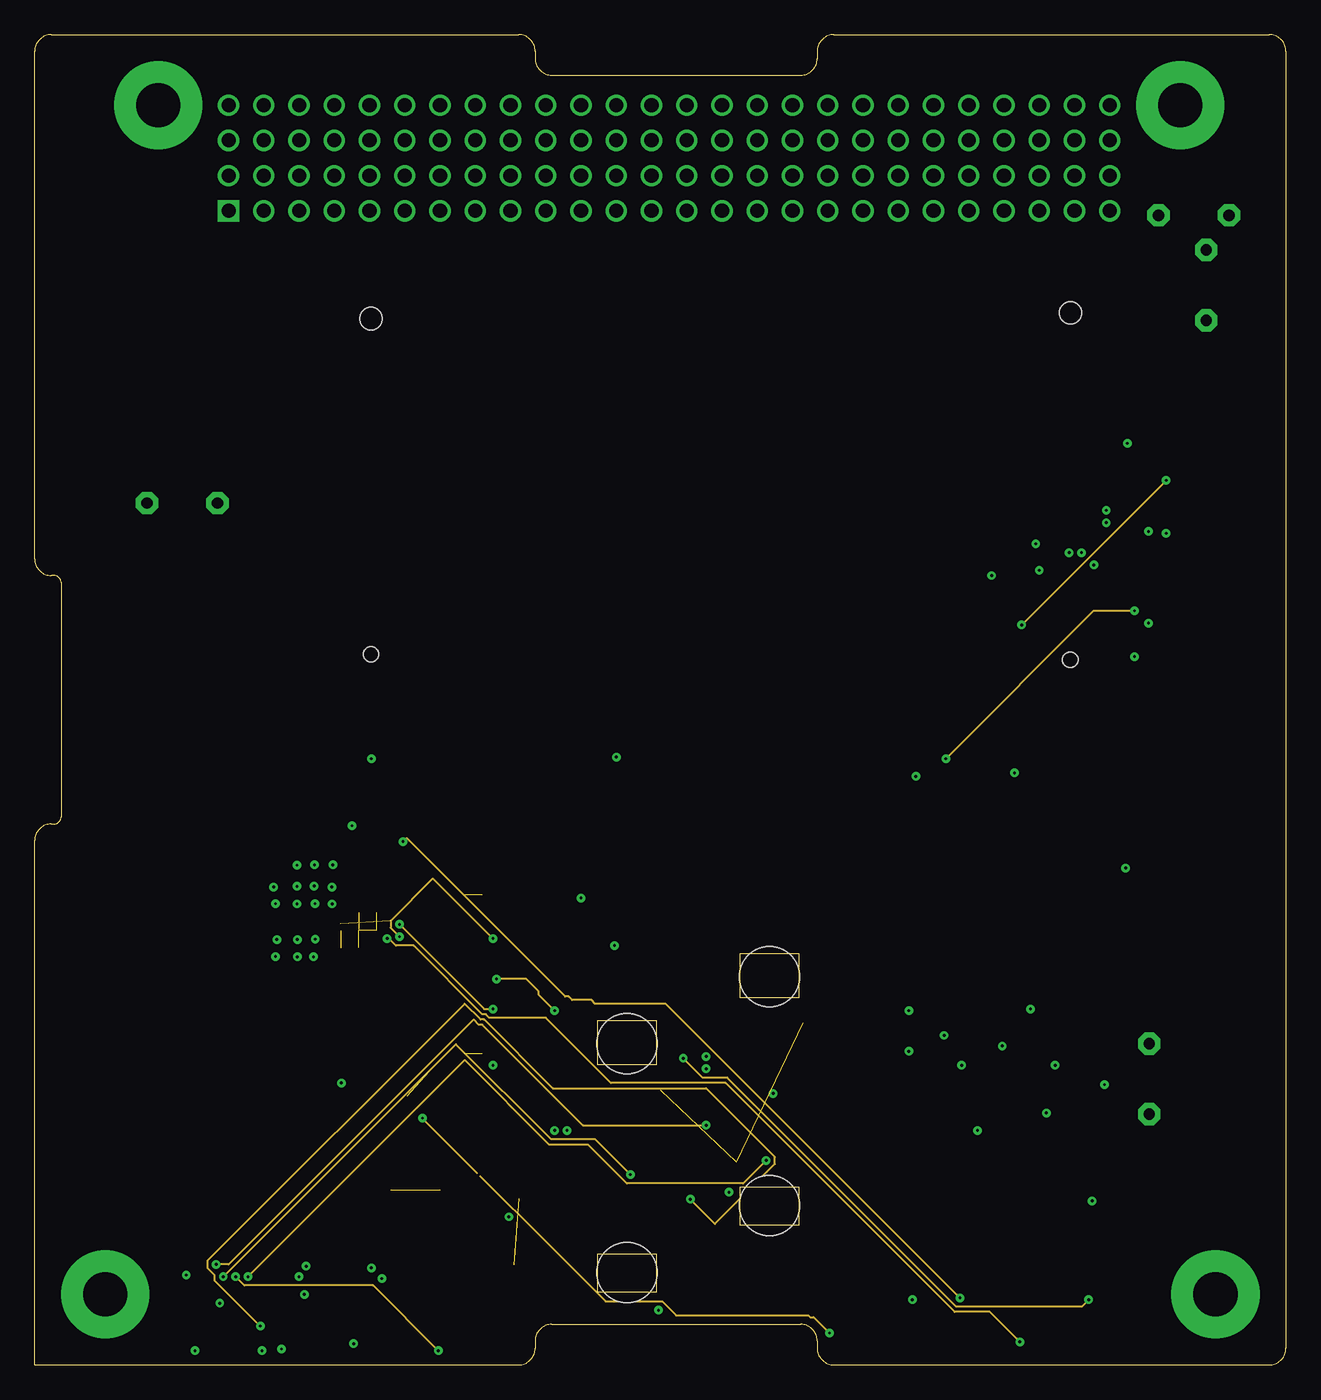
[diagram p6: board, inner layer Route2]
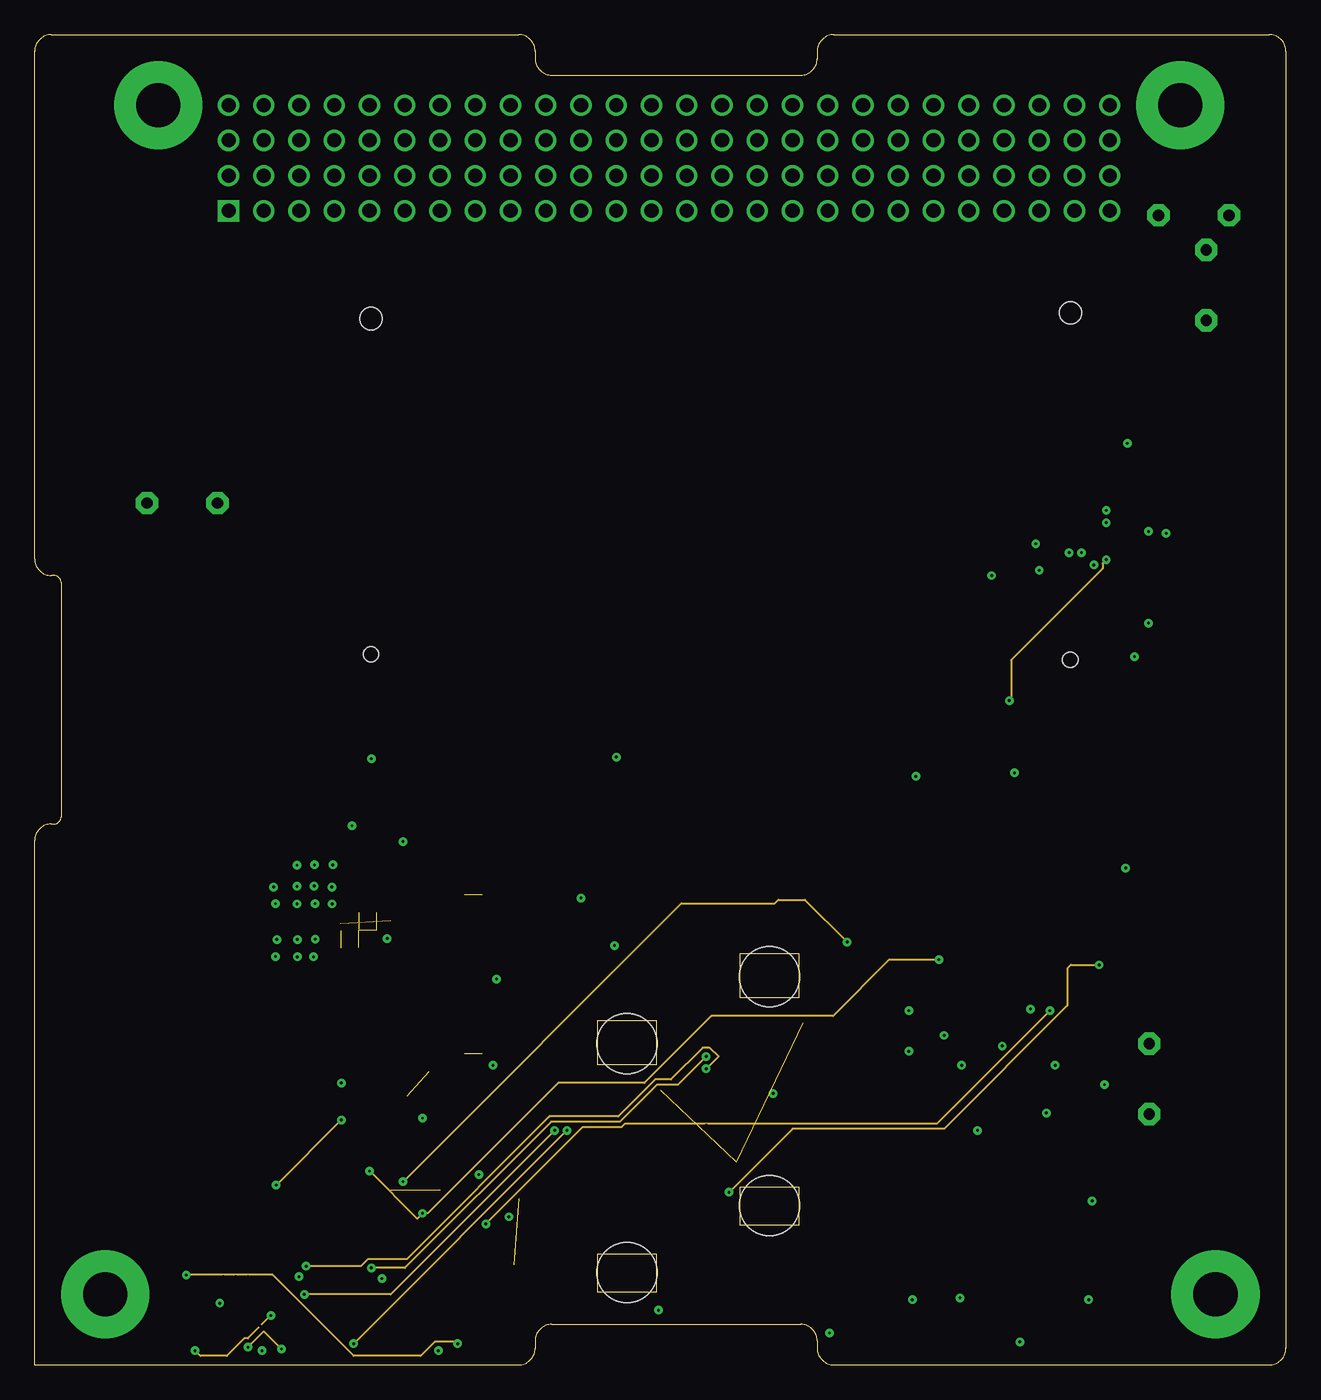
[diagram p7: board, inner layer Route15]
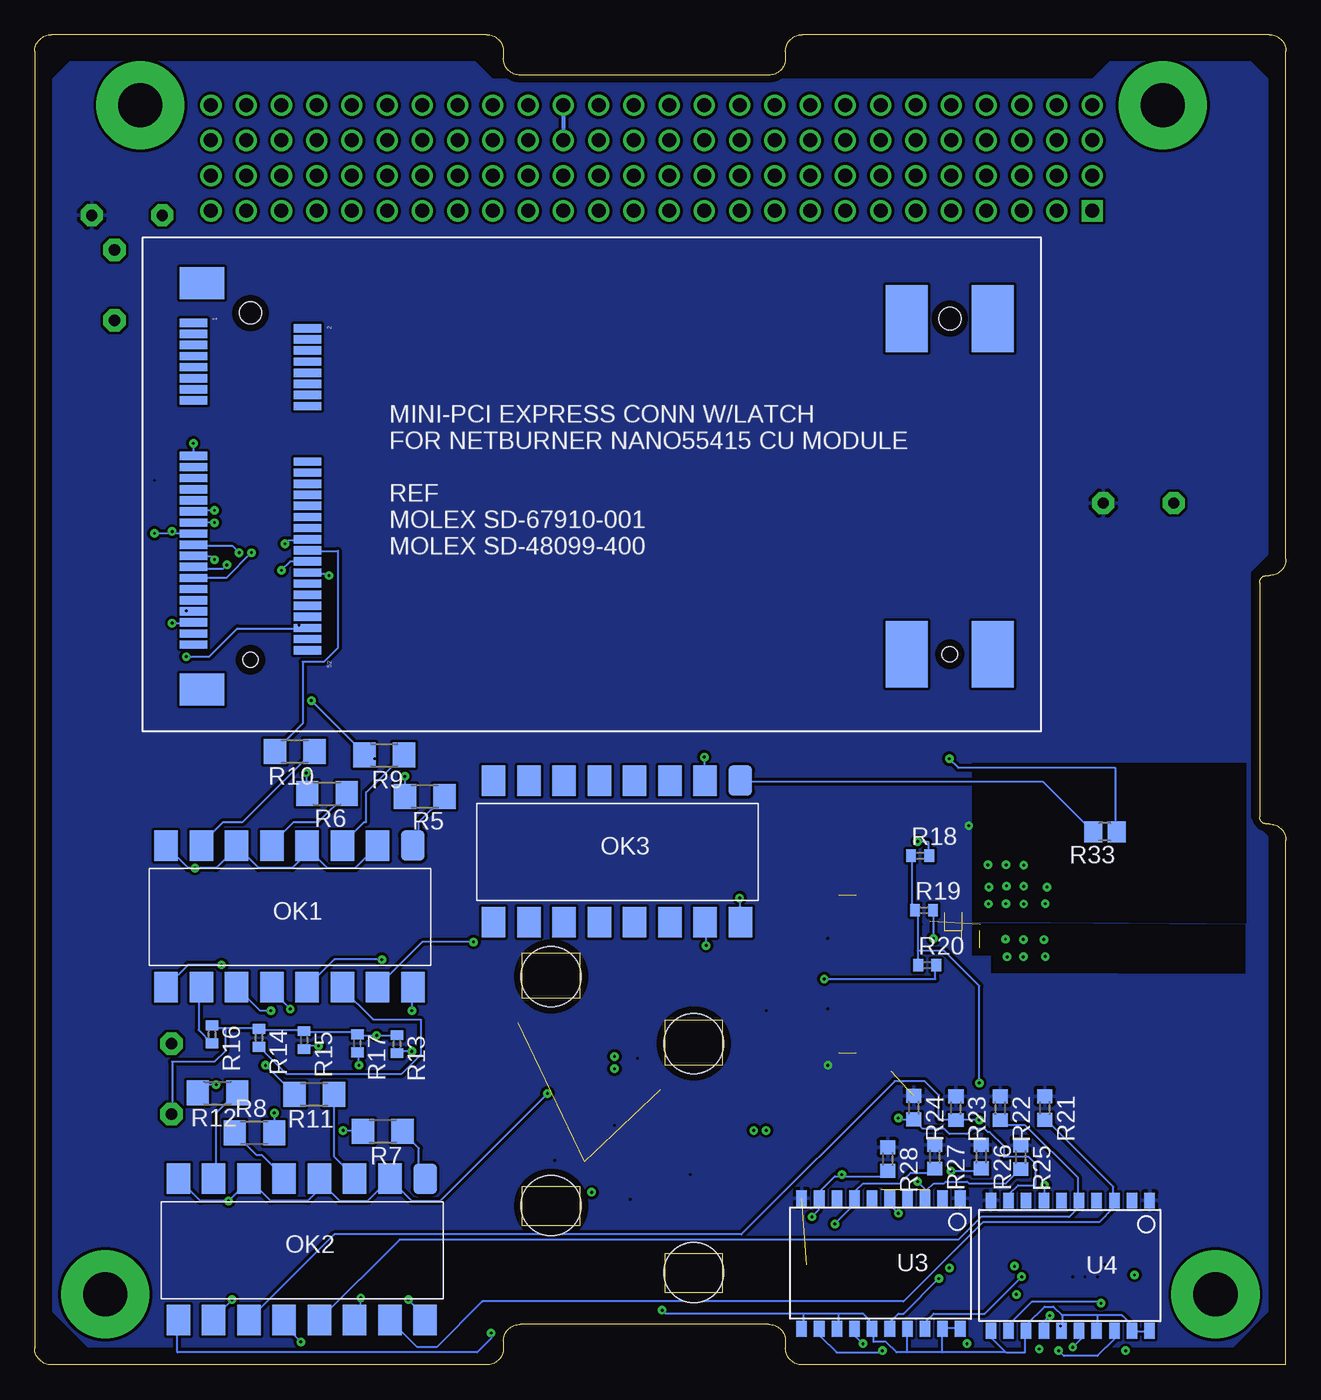
[diagram p8: board, bottom side, seen from below]

Size 90.17 x 95.89 mm. Coordinates in mm from the lower left corner, seen from the top.
Outline: 0,0 34.87,0 arc90 36.07,1.19 36.07,1.73 arc-90 37.26,2.92 55.19,2.92 arc-90 56.39,1.73 56.39,1.19 arc90 57.58,0 88.98,0 arc90 90.17,1.19 90.17,94.69 arc90 88.98,95.89 57.58,95.89 arc90 56.39,94.69 56.39,94.16 arc-90 55.19,92.96 37.26,92.96 arc-90 36.07,94.16 36.07,94.69 arc90 34.87,95.89 1.19,95.89 arc90 0,94.69 0,58.09 arc90 1.19,56.9 1.4,56.9 arc-90 1.91,56.39 1.91,39.5 arc-90 1.4,38.99 1.19,38.99 arc90 0,37.8 0,0
Copper layers [2:(1+(2*15)+16):15]: Top 0.0694mm / dielectric 8mil / Route2 0.0347mm / dielectric 3.5mil / Route15 0.0347mm / dielectric 8mil / Bottom 0.0694mm
Design rules "SSC-EAGLE-6Lyr_v1.0.0.3 *": minimum track width 6mil, minimum drill 8mil, track to track 6mil, track to pad 6mil, pad to pad 6mil, via to via 6mil, smd to smd 6mil, copper to edge 20mil, drill to drill 16mil, minimum pad ring 8mil, minimum via ring 8mil, stop-mask expansion 3mil, vias tented up to drill 0mil, thermal gap 10mil

### Footprints (pad centres in the part's own frame; a part is rotated, then mirrored left to right if it is on the bottom)
OS-CON-SVPF-F12 = smd 1.9 x 4.4: A1 0,-4.3; K1 0,4.4
MLCC-X7R-1210 = smd 1 x 2.8: 1 1.6,0.05; 2 -1.35,0.05
C1210K = smd 1.5 x 2.9: 1 -1.5,0; 2 1.5,0
CSK_MOUNTING_HOLE = drill 3.175 pad 6.35: P$1 0,0
05 = drill 0.813 pad 1.6 octagon: 1 -2.54,0; 2 2.54,0
CSK-BUS-PKG = drill 1.016 pad 1.524 square: 1 -29.21,-3.81 | drill 1.016 pad 1.524: 2 -29.21,-1.27; 3 -26.67,-3.81; 4 -26.67,-1.27; 5 -24.13,-3.81; 6 -24.13,-1.27; 7 -21.59,-3.81; 8 -21.59,-1.27; 9 -19.05,-3.81; 10 -19.05,-1.27; 11 -16.51,-3.81; 12 -16.51,-1.27; 13 -13.97,-3.81; 14 -13.97,-1.27; 15 -11.43,-3.81; 16 -11.43,-1.27; 17 -8.89,-3.81; 18 -8.89,-1.27; 19 -6.35,-3.81; 20 -6.35,-1.27; 21 -3.81,-3.81; 22 -3.81,-1.27; 23 -1.27,-3.81; 24 -1.27,-1.27; 25 1.27,-3.81; 26 1.27,-1.27; 27 3.81,-3.81; 28 3.81,-1.27; 29 6.35,-3.81; 30 6.35,-1.27; 31 8.89,-3.81; 32 8.89,-1.27; 33 11.43,-3.81; 34 11.43,-1.27; 35 13.97,-3.81; 36 13.97,-1.27; 37 16.51,-3.81; 38 16.51,-1.27; 39 19.05,-3.81; 40 19.05,-1.27; 41 21.59,-3.81; 42 21.59,-1.27; 43 24.13,-3.81; 44 24.13,-1.27; 45 26.67,-3.81; 46 26.67,-1.27; 47 29.21,-3.81; 48 29.21,-1.27; 49 31.75,-3.81; 50 31.75,-1.27; 51 34.29,-3.81; 52 34.29,-1.27; 53 -29.21,1.27; 54 -29.21,3.81; 55 -26.67,1.27; 56 -26.67,3.81; 57 -24.13,1.27; 58 -24.13,3.81; 59 -21.59,1.27; 60 -21.59,3.81; 61 -19.05,1.27; 62 -19.05,3.81; 63 -16.51,1.27; 64 -16.51,3.81; 65 -13.97,1.27; 66 -13.97,3.81; 67 -11.43,1.27; 68 -11.43,3.81; 69 -8.89,1.27; 70 -8.89,3.81; 71 -6.35,1.27; 72 -6.35,3.81; 73 -3.81,1.27; 74 -3.81,3.81; 75 -1.27,1.27; 76 -1.27,3.81; 77 1.27,1.27; 78 1.27,3.81; 79 3.81,1.27; 80 3.81,3.81; 81 6.35,1.27; 82 6.35,3.81; 83 8.89,1.27; 84 8.89,3.81; 85 11.43,1.27; 86 11.43,3.81; 87 13.97,1.27; 88 13.97,3.81; 89 16.51,1.27; 90 16.51,3.81; 91 19.05,1.27; 92 19.05,3.81; 93 21.59,1.27; 94 21.59,3.81; 95 24.13,1.27; 96 24.13,3.81; 97 26.67,1.27; 98 26.67,3.81; 99 29.21,1.27; 100 29.21,3.81; 101 31.75,1.27; 102 31.75,3.81; 103 34.29,1.27; 104 34.29,3.81
M80-68112 = smd 1 x 3.2: 1 0,2.4; 2 2,2.4; 3 4,2.4; 4 6,2.4; 5 8,2.4; 6 10,2.4; 7 10,-2.4; 8 8,-2.4; 9 6,-2.4; 10 4,-2.4; 11 2,-2.4; 12 0,-2.4 | hole 4.318: -3.175,0; 13.335,0
MSS1048 = smd 3.56 x 1.78: 1 5,9.85; 2 5,0.35
SERIES-POWER-INDUCTORS = smd 2.85 x 2 rotated 45: 1 1.75,1.6; 2 -1.65,-1.75
PS2501L-4 = smd 2.2 x 1.7: 1 -1.6,19.03; 2 -1.6,16.49; 3 -1.6,13.95; 4 -1.6,11.41; 5 -1.6,8.87; 6 -1.6,6.33; 7 -1.6,3.79; 8 -1.6,1.25; 9 8.6,1.25; 10 8.6,3.79; 11 8.6,6.33; 12 8.6,8.87; 13 8.6,11.41; 14 8.6,13.95; 15 8.6,16.49; 16 8.6,19.03
1206-8-CHIPFET = smd 2.032 x 1.727: D 0,1.321 | smd 0.559 x 0.406: G -0.736,0; S 0.736,0
R1206 = smd 1.6 x 1.803: 1 -1.422,0; 2 1.422,0
R0603 = smd 1 x 1.1: 1 -0.85,0; 2 0.85,0
R0805 = smd 1.3 x 1.5: 1 -0.95,0; 2 0.95,0
R0402 = smd 0.7 x 0.9: 1 -0.65,0; 2 0.65,0
R0805' = smd 1.3 x 1.5: 1 -0.85,0; 2 0.85,0
1P-TP-MILLMAX-11 = smd 2.794 x 2.794: 1 0,0
MOLEX-MINI-PCI-EXPRESS-8MM-52CKT = smd 0.6 x 2: 1 -11.65,-26.8; 2 -11.248,-18.576; 3 -10.85,-26.8; 4 -10.447,-18.576; 5 -10.05,-26.8; 6 -9.648,-18.576; 7 -9.25,-26.8; 8 -8.848,-18.576; 9 -8.45,-26.8; 10 -8.047,-18.576; 11 -7.65,-26.8; 12 -7.247,-18.576; 13 -6.85,-26.8; 14 -6.447,-18.576; 15 -6.05,-26.8; 16 -5.647,-18.576; 17 -2.05,-26.8; 18 -1.647,-18.576; 19 -1.25,-26.8; 20 -0.848,-18.576; 21 -0.45,-26.8; 22 -0.048,-18.576; 23 0.35,-26.8; 24 0.752,-18.576; 25 1.15,-26.8; 26 1.552,-18.576; 27 1.95,-26.8; 28 2.353,-18.576; 29 2.75,-26.8; 30 3.152,-18.576; 31 3.55,-26.8; 32 3.953,-18.576; 33 4.35,-26.8; 34 4.753,-18.576; 35 5.15,-26.8; 36 5.553,-18.576; 37 5.95,-26.8; 38 6.353,-18.576; 39 6.75,-26.8; 40 7.152,-18.576; 41 7.55,-26.8; 42 7.952,-18.576; 43 8.35,-26.8; 44 8.752,-18.576; 45 9.15,-26.8; 46 9.553,-18.576; 47 9.95,-26.8; 48 10.352,-18.576; 49 10.75,-26.8; 50 11.152,-18.576; 51 11.55,-26.8; 52 11.953,-18.576 | smd 2.3 x 3.2: P$1 -14.5,-26.2; P$2 14.8,-26.2 | smd 4.8 x 3: P$3 12.25,24.6; P$4 -11.95,24.6; P$5 -11.95,30.8; P$6 12.25,30.8 | hole 1.6: -12.35,-22.7; -11.95,27.7 | hole 1.1: 12.65,-22.7; 12.25,27.7
LGA-141-LTC-05-08-1840-B = smd 0.63 x 0.63: A1 -7.116,-10.192; A2 -5.846,-10.192; A3 -4.576,-10.192; A4 -3.306,-10.192; A5 -2.036,-10.192; A6 -0.766,-10.192; A7 0.504,-10.192; A8 1.774,-10.192; A9 3.044,-10.192; A10 4.314,-10.192; A11 5.584,-10.192; A12 6.854,-10.192; B1 -7.116,-8.922; B2 -5.846,-8.922; B3 -4.576,-8.922; B4 -3.306,-8.922; B5 -2.036,-8.922; B6 -0.766,-8.922; B7 0.504,-8.922; B8 1.774,-8.922; B9 3.044,-8.922; B10 4.314,-8.922; B11 5.584,-8.922; B12 6.854,-8.922; C1 -7.116,-7.652; C2 -5.846,-7.652; C3 -4.576,-7.652; C4 -3.306,-7.652; C5 -2.036,-7.652; C6 -0.766,-7.652; C7 0.504,-7.652; C8 1.774,-7.652; C9 3.044,-7.652; C10 4.314,-7.652; C11 5.584,-7.652; C12 6.854,-7.652; D1 -7.116,-6.382; D2 -5.846,-6.382; D3 -4.576,-6.382; D4 -3.306,-6.382; D5 -2.036,-6.382; D6 -0.766,-6.382; D7 0.504,-6.382; D8 1.774,-6.382; D9 3.044,-6.382; D10 4.314,-6.382; D11 5.584,-6.382; D12 6.854,-6.382; E1 -7.116,-5.112; E2 -5.846,-5.112; E3 -4.576,-5.112; E4 -3.306,-5.112; E5 -2.036,-5.112; E6 -0.766,-5.112; E7 0.504,-5.112; E8 1.774,-5.112; E9 3.044,-5.112; E10 4.314,-5.112; E11 5.584,-5.112; E12 6.854,-5.112; F1 -7.116,-3.842; F2 -5.846,-3.842; F3 -4.576,-3.842; F4 -3.306,-3.842; F5 -2.036,-3.842; F6 -0.766,-3.842; F10 4.314,-3.842; F11 5.584,-3.842; F12 6.854,-3.842; G1 -7.116,-2.572; G2 -5.846,-2.572; G3 -4.576,-2.572; G4 -3.306,-2.572; G5 -2.036,-2.572; G6 -0.766,-2.572; G7 0.504,-2.572; G8 1.774,-2.572; G9 3.044,-2.572; G10 4.314,-2.572; G11 5.584,-2.572; G12 6.854,-2.572; H2 -5.846,-1.302; H3 -4.576,-1.302; H4 -3.306,-1.302; H5 -2.036,-1.302; H6 -0.766,-1.302; H7 0.504,-1.302; H8 1.774,-1.302; H9 3.044,-1.302; H10 4.314,-1.302; H11 5.584,-1.302; H12 6.854,-1.302; J5 -2.036,-0.032; J6 -0.766,-0.032; J7 0.504,-0.032; J8 1.774,-0.032; J9 3.044,-0.032; J10 4.314,-0.032; J11 5.584,-0.032; J12 6.854,-0.032; K5 -2.036,1.238; K6 -0.766,1.238; K7 0.504,1.238; K8 1.774,1.238; K9 3.044,1.238; K10 4.314,1.238; K11 5.584,1.238; K12 6.854,1.238; L5 -2.036,2.508; L6 -0.766,2.508; L7 0.504,2.508; L8 1.774,2.508; L9 3.044,2.508; L10 4.314,2.508; L11 5.584,2.508; L12 6.854,2.508; M5 -2.036,3.778; M6 -0.766,3.778; M7 0.504,3.778; M8 1.774,3.778; M9 3.044,3.778; M10 4.314,3.778; M11 5.584,3.778; M12 6.854,3.778; SW1@J1 -7.116,-0.032; SW1@J2 -5.846,-0.032; SW1@J3 -4.576,-0.032; SW1@J4 -3.306,-0.032; SW1@K1 -7.116,1.238; SW1@K2 -5.846,1.238; SW1@K3 -4.576,1.238; SW1@K4 -3.306,1.238; SW1@L1 -7.116,2.508; SW1@L2 -5.846,2.508; SW1@L3 -4.576,2.508; SW1@L4 -3.306,2.508; SW1@M1 -7.116,3.778; SW1@M2 -5.846,3.778; SW1@M3 -4.576,3.778; SW1@M4 -3.306,3.778; VOUT -7.116,-1.302
20-LEAD-PLASTIC-SO = smd 0.762 x 1.143: 1 0,0; 2 1.27,0; 3 2.54,0; 4 3.81,0; 5 5.08,0; 6 6.35,0; 7 7.62,0; 8 8.89,0; 9 10.16,0; 10 11.43,0; 11 11.43,9.398; 12 10.16,9.398; 13 8.89,9.398; 14 7.62,9.398; 15 6.35,9.398; 16 5.08,9.398; 17 3.81,9.398; 18 2.54,9.398; 19 1.27,9.398; 20 0,9.398

### Placement (x,y rotation side)
C1  9.96,54.95 270 top
C2  22.67,40.99 180 top
C3  33.05,7.21 0 top
C4  31.13,3.1 0 top
C5  29.99,15.03 270 top
H1  8.89,90.81 0 top
H2  82.55,90.81 0 top
H3  85.09,5.08 0 top
HBL  5.08,5.08 0 top
J1  10.63,62.12 0 top
J2  43.18,87 0 top
J3  83.52,82.86 0 top
J4  80.32,20.61 90 top
J5  52.96,14.65 90 top
J6  42.68,9.82 90 top
J7  84.42,77.83 270 top
L1  6.51,19.8 0 top
L2  3.63,37.99 0 top
L3  26.69,5.67 0 top
OK1  81.95,35.83 270 bottom
OK2  81.06,11.81 270 bottom
OK3  58.35,40.52 270 bottom
Q1  17.76,7.09 0 top
Q2  11.41,7.19 0 top
Q3  14.61,7.14 0 top
Q4  17.79,1.65 0 top
Q5  21.42,1.63 0 top
Q6  11.41,1.71 0 top
Q7  21.12,7.09 0 top
Q8  14.72,1.78 0 top
R1  26.57,36.97 0 top
R2  34.35,28.14 270 top
R3  22.98,31.8 0 top
R4  34.74,33.66 270 top
R5  62.06,40.99 180 bottom
R6  69.11,41.17 180 bottom
R7  65.09,16.85 180 bottom
R8  74.33,16.71 0 bottom
R9  64.99,43.96 180 bottom
R10  71.43,44.22 180 bottom
R11  70.02,19.51 180 bottom
R12  77,19.59 180 bottom
R13  64.07,23.12 270 bottom
R14  74.01,23.56 270 bottom
R15  70.76,23.41 270 bottom
R16  77.39,23.83 270 bottom
R17  66.92,23.18 270 bottom
R18  26.36,36.7 0 bottom
R19  26.08,32.77 0 bottom
R20  25.85,28.8 0 bottom
R21  17.38,18.51 270 bottom
R22  20.6,18.49 270 bottom
R23  23.79,18.49 270 bottom
R24  26.83,18.54 270 bottom
R25  19.12,14.96 270 bottom
R26  21.96,15.01 270 bottom
R27  25.32,15 270 bottom
R28  28.7,14.83 270 bottom
R29  21.12,10.95 0 top
R30  14.56,11.23 0 top
R31  21.07,5.46 0 top
R32  14.61,5.39 0 top
R33  1K  [R0805']  13.05,38.42 180 bottom
R34  604R  [R0805']  65.36,35.42 180 top
TP1  85.28,52.55 0 top
TP2  85.33,56.61 0 top
TP3  85.23,60.78 0 top
TP4  85.18,65.5 0 top
TP5  85.15,69.42 0 top
U1  51.93,63.47 270 bottom
U2  22.05,28.28 90 top
U3  23.47,12.01 180 bottom
U4  9.83,11.84 180 bottom

### Tracks (layer width: path | path; a pad name or v marks a point on that pad's centre or on a via)
CH1_P18H  (via drill 0.2)
  Top 0.152: v24.26,6.99 21.97,6.99 Q7.S | v48.39,22.23 50.55,22.23 50.55,22.61 J5.5
  Route15 0.152: v24.26,6.99 26.67,6.99 37.21,17.53 42.16,17.53 44.83,20.19 46.35,20.19 v48.39,22.23
CH1_P18L  (via drill 0.2)
  Top 0.152: v19.56,7.11 18.54,7.11 Q1.S | v48.39,21.34 49.02,20.7 50.55,20.7 J5.4
  Route15 0.152: v19.56,7.11 23.5,7.11 24,7.62 26.8,7.62 37.08,17.91 42.04,17.91 44.7,20.57 45.85,20.57 48.13,22.86 48.64,22.86 49.28,22.23 v48.39,21.34
CH1_TP  (via drill 0.2, 0.2 layers 1-2)
  Top 0.152: J6.2 40.39,11.94 43.05,11.94 43.05,12.32 43.43,12.7 48.26,12.7 48.26,15.24 49.66,16.64 50.55,16.64 J5.2 50.67,16.76 53.09,16.76 53.09,17.4 53.47,17.78 58.29,17.78 58.29,24.64 | 65.53,33.66 65.53,31.88 58.29,24.64 | 65.53,33.66 65.53,34.67 66.17,35.31 R34.1 66.29,35.43 66.29,48.51 v71.12,53.34 | 58.29,24.64 56.39,22.73 55.37,22.73 J5.8 | 65.53,33.66 47.37,33.66 | 47.37,33.66 v39.37,33.66 | v81.53,63.75 81.53,65.79 85.09,69.34 TP5.1 | 47.37,33.66 47.37,17.91 45.09,17.91 J6.8
  Route2 0.152: v71.12,53.34 v81.53,63.75
  Bottom 0.152: v39.37,33.66 39.37,32 OK3.16
CH1H  (via drill 0.2)
  Top 0.152: v25.02,6.22 21.21,6.22 20.45,6.99 Q7.G
  Bottom 0.152: v25.02,6.22 27.56,3.68 27.94,3.68 28.45,3.17 28.45,2.67 U3.16
CH1L  (via drill 0.2)
  Top 0.152: v19.05,6.35 19.05,6.22 17.91,6.22 17.14,6.99 Q1.G
  Bottom 0.152: v19.05,6.35 21.72,3.68 25.4,3.68 25.91,3.17 25.91,2.67 U3.18
CH1S
  Top 0.152: R29.1 20.57,10.92 21.08,10.41 21.08,8.51 Q7.D
CH2_P18H  (via drill 0.2 layers 1-2)
  Top 0.152: v15.37,6.35 15.37,7.11 Q3.S | v52.7,14.73 54.61,16.64 55.24,16.64 J5.11
  Route2 0.152: v15.37,6.35 30.99,21.97 37.08,15.88 39.88,15.88 42.67,13.08 51.05,13.08 v52.7,14.73
CH2_P18L  (via drill 0.2 layers 1-2)
  Top 0.152: v13.08,7.24 12.19,7.24 Q2.S | v48.39,17.27 48.9,17.78 52.96,17.78 53.72,18.54 55.24,18.54 J5.10
  Route2 0.152: v13.08,7.24 13.97,7.24 31.62,24.89 32,24.51 32.26,24.51 39.5,17.27 v48.39,17.27
CH2H  (via drill 0.2, 0.2 layers 1-2)
  Top 0.152: v14.48,6.35 14.48,6.6 13.97,7.11 Q3.G
  Route2 0.152: v14.48,6.35 15.11,5.71 24.38,5.71 v29.08,1.02
  Bottom 0.152: v29.08,1.02 29.21,0.89 32.38,0.89 33.53,2.03 33.53,2.54 U3.12
CH2L  (via drill 0.2, 0.2 layers 15-16)
  Top 0.152: v10.92,6.48 10.92,6.99 10.79,7.11 Q2.G
  Route15 0.152: v10.92,6.48 17.14,6.48 22.99,0.64 27.81,0.64 28.83,1.65 30.35,1.65 v30.48,1.52
  Bottom 0.152: v30.48,1.52 30.99,2.03 30.99,2.54 U3.14
CH2S
  Top 0.152: R30.1 13.97,11.18 14.61,10.54 14.61,8.51 Q3.D
CH3_P18H  (via drill 0.2)
  Top 0.152: v22.99,1.52 22.23,1.52 Q5.S | v38.35,16.89 39.24,17.78 40.26,17.78 J6.5
  Route15 0.152: v38.35,16.89 v22.99,1.52
CH3_P18L  (via drill 0.2)
  Top 0.152: v19.43,5.08 19.43,1.78 18.54,1.78 Q4.S | v37.47,16.89 38.35,16 40.26,16 40.26,15.88 J6.4
  Route15 0.152: v19.43,5.08 25.65,5.08 v37.47,16.89
CH3H  (via drill 0.2, 0.2 layers 15-16)
  Top 0.152: v17.78,1.14 19.3,1.14 19.68,1.52 20.57,1.52 Q5.G
  Route15 0.152: v17.78,1.14 16.51,2.41 v15.37,1.27
  Bottom 0.152: v15.37,1.27 14.73,1.91 14.73,2.41 14.86,2.41 U4.16
CH3L  (via drill 0.2)
  Top 0.152: v16.38,1.02 17.02,1.65 Q4.G
  Bottom 0.152: v16.38,1.02 16,0.64 13.59,0.64 12.32,1.91 12.32,2.41 U4.18
CH3S
  Top 0.152: R31.1 20.45,5.46 21.34,4.57 21.34,3.05 Q5.D
CH4_P18H  (via drill 0.2 layers 1-2)
  Top 0.152: v16.26,2.79 16.26,1.91 15.49,1.91 Q8.S | v47.24,11.94 47.12,12.06 45.09,12.06 45.09,11.94 J6.11
  Route2 0.152: v16.26,2.79 12.95,6.1 12.95,6.48 12.45,6.99 12.45,7.49 30.99,26.04 32.13,24.89 32.38,24.89 37.34,19.94 48.39,19.94 53.34,14.99 53.34,14.48 49.02,10.16 v47.24,11.94
CH4_P18L  (via drill 0.2 layers 1-2)
  Top 0.152: v13.59,6.35 12.7,5.46 12.7,4.19 12.83,4.06 12.83,1.78 12.19,1.78 Q6.S | v42.93,13.72 44.96,13.72 J6.10
  Route2 0.152: v13.59,6.35 30.35,23.11 37.21,16.26 40.39,16.26 v42.93,13.72
CH4H  (via drill 0.2)
  Top 0.152: v13.34,4.45 13.34,1.91 13.97,1.91 Q8.G
  Bottom 0.152: v13.34,4.45 13.46,4.57 18.29,4.57 19.94,2.92 19.94,2.54 U4.12
CH4L  (via drill 0.2, 0.2 layers 15-16)
  Top 0.152: v11.56,1.02 11.56,1.65 10.79,1.65 Q6.G
  Route15 0.152: v11.56,1.02 11.94,0.64 13.84,0.64 15.11,1.91 15.37,1.91 v17.02,3.56
  Bottom 0.152: v17.02,3.56 17.53,3.05 17.53,2.54 U4.14
CH4S
  Top 0.152: R32.1 13.97,5.33 14.61,4.7 14.61,3.17 Q8.D
I2C(CLK)  (via drill 0.2)
  Top 0.152: v77.22,61.59 67.31,71.5 J2.43
  Bottom 0.152: v77.22,61.59 78.61,61.59 U1.27
I2C(DATA)  (via drill 0.2)
  Top 0.152: v77.22,60.71 64.77,73.15 J2.41
  Bottom 0.152: v77.22,60.71 78.61,60.71 U1.29
INTVCC  (via drill 0.2 layers 1-2)  (1 unrouted)
  Top 0.152: v26.29,30.86 26.29,28.19 26.54,27.94 26.54,26.92 25.91,26.29 U2.F5 | v33.02,30.73 32.26,30.73 32.26,31.24 U2.A9 32.26,31.37 32.26,31.5 33.27,32.51 33.27,33.66 35.81,33.66 36.83,34.67 36.83,35.31 64.39,35.31 R34.2 64.52,35.43 64.52,42.55 v65.66,43.69 | v79.25,54.36 79.25,54.74 85.22,60.71 TP3.1
  Route2 0.152: v26.29,30.86 25.65,31.5 25.65,32 28.7,35.05 v33.02,30.73 | v79.25,54.36 76.33,54.36 v65.66,43.69
N$2
  cutout Top (isolate 0.254): 32.69,24.38 31.62,24.38 31.62,25.62 30.44,25.62 30.44,31.94 31.69,31.94 31.69,33.12 31.69,33.19 32.88,33.19 32.88,32.06 32.88,24.38 32.06,24.38
N$4  (via drill 0.2)
  Top 0.152: v62.99,25.53 v62.99,22.61
  Bottom 0.152: v62.99,22.61 63.88,22.61 64.01,22.48 R13.2 | v62.99,25.53 62.99,27.18 OK1.16
N$5
  Bottom 0.152: R14.2 73.91,22.86 72.01,20.95 63.75,20.95 62.36,22.35 62.36,24.89 65.79,24.89 68.07,27.18 OK1.14
N$7  (via drill 0.2)
  Top 0.152: v69.72,22.99 71.75,25.02 v71.75,25.65
  Bottom 0.152: v69.72,22.99 70.61,22.99 70.74,22.86 R15.2 | v71.75,25.65 73.03,26.92 73.03,27.18 OK1.12
N$8
  Top 0.152: U2.B6 30.99,27.43 31.62,26.8 31.62,20.57 32,20.19 34.29,20.19 34.29,27.18 R2.2
N$9
  Bottom 0.152: R16.2 77.47,23.24 78.36,24.13 78.36,27.18 78.23,27.18 OK1.10
N$10  (via drill 0.2)
  Top 0.152: v66.8,21.59 63.25,18.03 v63.25,4.7
  Bottom 0.152: v66.8,21.59 66.8,22.48 R17.2 | v63.25,4.7 62.1,3.56 62.1,3.3 OK2.16
N$11  (via drill 0.2)
  Route2 0.152: v26.54,37.72 26.8,37.97 38.23,26.54 38.48,26.54 38.73,26.29 40.13,26.29 40.39,26.04 45.47,26.04 v66.67,4.83
  Bottom 0.152: v26.54,37.72 25.78,37.72 25.78,36.7 R18.2 | v66.67,4.83 66.67,3.3 67.06,3.3 OK2.14
N$12  (via drill 0.2)
  Route2 0.152: v25.4,30.73 25.53,30.73 26.04,30.23 27.3,30.23 32.26,25.27 32.51,25.27 32.77,25.02 36.83,25.02 41.53,20.32 49.78,20.32 66.29,3.81 68.83,3.81 v70.99,1.65
  Bottom 0.152: v25.4,30.73 25.4,32.64 R19.2 | v70.99,1.65 72.14,2.79 72.14,3.17 OK2.12
N$13  (via drill 0.2, 0.2 layers 1-2)
  Top 0.152: v37.47,25.53 41.27,25.53 41.66,25.91 43.81,25.91 46.74,22.99 v46.74,22.1
  Route2 0.152: v33.27,27.81 35.43,27.81 36.32,26.92 36.32,26.67 v37.47,25.53 | v75.95,4.7 75.44,4.19 66.42,4.19 49.91,20.7 48.13,20.7 v46.74,22.1
  Bottom 0.152: v33.27,27.81 25.27,27.81 25.27,28.7 R20.2 | v75.95,4.7 77.34,3.3 OK2.10
N$15
  pour Bottom: 3.15,42.98 21.59,42.98 22.17,42.39 22.17,35.92 22.58,35.51 22.58,32.26 22.68,32.16 22.63,32.16 22.5,32.03 17.96,32.03 17.86,32.13 3.56,32.13 3.07,32.61 3.07,42.82
N$16
  Bottom 0.152: R33.2 13.97,38.48 17.53,42.04 39.24,42.04 OK3.1
N$21
  Top 0.152: HBL.P$1 5.08,10.03 2.54,12.57 2.54,84.45 H1.P$1 10.03,91.95 77.85,91.95 78.99,90.81 H2.P$1 87.76,85.6 87.76,52.58 85.09,49.91 H3.P$1
OK1E1  (via drill 0.2 layers 15-16)
  Route15 0.152: v58.55,30.48 55.5,33.53 53.59,33.53 53.34,33.27 46.61,33.27 v26.54,13.21
  Bottom 0.152: 25.91,12.57 25.4,13.08 24.64,13.08 24.51,13.21 22.99,13.21 22.86,13.08 20.19,13.08 19.18,14.1 R25.2 | 25.91,12.57 25.91,12.06 U3.3 25.91,12.57 | v58.55,30.48 62.23,30.48 65.41,27.3 OK1.15 | 25.91,12.57 v26.54,13.21
OK1E2  (via drill 0.2 layers 15-16)
  Route15 0.152: v24.13,13.97 27.56,10.54 v27.94,10.92 28.32,10.92 37.72,20.32 43.94,20.32 48.77,25.15 57.53,25.15 61.59,29.21 v65.15,29.21
  Bottom 0.152: v24.13,13.97 22.1,13.97 21.97,14.1 R26.2 | v27.94,10.92 28.45,11.43 28.45,11.94 U3.5 | v65.15,29.21 68.58,29.21 70.48,27.3 OK1.13
OK1E3  (via drill 0.2 layers 15-16)
  Route15 0.152: v73.15,25.53 65.02,17.4 42.55,17.4 42.29,17.14 39.5,17.14 v32.51,10.16
  Bottom 0.152: R27.2 25.4,14.1 25.65,13.84 27.05,13.84 27.81,13.08 30.48,13.08 30.99,12.57 30.99,12.06 U3.7 31.11,11.94 31.11,11.56 v32.51,10.16 | v73.15,25.53 73.91,25.53 75.56,27.18 OK1.11
OK1E4  (via drill 0.2, 0.2 layers 15-16)
  Top 0.152: v34.16,10.67 48.26,10.67 v50.04,12.45
  Route15 0.152: v76.71,28.83 74.68,28.83 74.42,28.57 74.42,25.91 65.53,17.02 54.61,17.02 v50.04,12.45
  Bottom 0.152: 32,13.59 32.51,13.59 33.53,12.57 33.53,12.06 U3.9 33.66,11.94 33.66,11.18 v34.16,10.67 | 32,13.59 29.08,13.59 R28.2 | v76.71,28.83 79.12,28.83 80.64,27.3 OK1.9 | 32,13.59 v32,13.72
OK2E1
  Bottom 0.152: R21.2 17.27,17.65 12.45,12.83 12.45,11.94 U4.3 12.45,11.81 12.45,11.3 13.46,10.29 21.84,10.29 27.56,4.57 57.91,4.57 61.21,1.27 62.61,1.27 64.52,3.17 OK2.15
OK2E2
  Bottom 0.152: R22.2 20.57,17.53 20.32,17.27 18.8,17.27 14.99,13.46 14.99,11.94 U4.5 14.99,11.81 14.99,11.3 15.62,10.67 21.97,10.67 23.62,9.02 63.88,9.02 69.6,3.3 OK2.13
OK2E3  (via drill 0.2 layers 15-16)
  Route15 0.152: v17.4,12.95 v22.1,17.65
  Bottom 0.152: v22.1,17.65 23.75,17.65 R23.2 23.88,17.65 25.02,17.65 25.02,19.43 26.04,20.45 28.19,20.45 39.24,9.4 68.58,9.4 74.68,3.3 OK2.11 | v17.4,12.95 17.4,11.94 U4.7
OK2E4  (via drill 0.2)
  Route2 0.152: v57.28,2.29 56.13,3.43 55.88,3.43 55.75,3.56 46.23,3.56 45.21,4.57 41.15,4.57 v27.94,17.78
  Bottom 0.152: U4.9 19.94,11.94 19.94,12.32 19.3,12.95 18.03,12.95 18.03,14.48 18.54,14.99 20.32,14.99 20.32,15.75 21.34,16.76 21.46,16.76 21.72,17.02 22.61,17.02 22.99,16.64 24.26,16.64 24.64,17.02 26.16,17.02 26.8,17.65 R24.2 26.92,17.65 27.81,17.65 v27.94,17.78 | v57.28,2.29 57.28,1.91 58.29,0.89 79.88,0.89 79.88,3.17 OK2.9
P18_SW1
  Bottom 0.152: R5.1 60.71,40.89 62.48,39.12 62.48,37.47 62.87,37.47 OK1.1
P18_SW2
  Bottom 0.152: R6.1 67.69,41.15 69.72,39.12 71.5,39.12 73.15,37.47 OK1.5
P18_SW3
  Bottom 0.152: R7.1 63.63,16.76 62.48,15.62 62.48,13.46 62.1,13.46 OK2.1
P18_SW4
  Bottom 0.152: R8.1 75.69,16.64 74.17,15.11 73.79,15.11 72.14,13.46 OK2.5
P18_SW5
  Bottom 0.152: R9.1 63.63,43.94 66.29,41.27 66.29,39.12 66.42,39.12 68.07,37.47 OK1.3
P18_SW6
  Bottom 0.152: R10.1 70.1,44.2 75.18,39.12 76.58,39.12 78.23,37.47 OK1.7
P18_SW7
  Bottom 0.152: R11.1 68.58,19.43 68.58,14.99 67.06,13.46 OK2.3
P18_SW8
  Bottom 0.152: R12.1 75.69,19.56 77.09,18.16 77.09,13.46 77.22,13.46 OK2.7
PGND  (via drill 0.2)  (6 unrouted)
  Top 0.152: 32.89,26.29 32.26,26.29 U2.A5 | 32.26,23.75 U2.A3 32.26,23.75
  other vias: 22.86,38.86 33.02,21.59
  pour Top (isolate 0.254): 22.81,43.38 25.62,43.38 36.38,43.38 36.38,42.94 36.38,42.62 36.38,28.69 48.88,28.69 50.56,30.38 56,30.38 57.88,28.5 57.88,10.88 55.75,8.75 48.88,8.75 48.19,8.75 46.38,6.94 46.38,5.38 44.62,3.62 36.44,3.62 36.25,3.44 33.5,0.69 31.88,0.69 31,1.56 31,4.81 30,5.81 30,6.88 30.56,7.44 30.56,5.69 31.19,5.06 32.12,5.06 32.94,5.88 32.94,9.38 29.81,12.5 29.81,18.25 27.88,20.19 27.88,21 27.88,23.12 26.62,23.12 26.62,25.62 25.38,25.62 26.62,25.75 26.62,28.19 26.62,29.75 26.62,31.44 26.62,33.56 26.69,38.69 22.75,38.69 22.75,43.38
  pour Bottom: 3.81,93.98 12.7,93.98 13.97,92.71 35.56,92.71 57.15,92.71 58.42,93.98 87.63,93.98 88.9,92.71 88.9,71.12 88.9,3.81 86.36,1.27 58.42,1.27 55.88,3.81 36.83,3.81 35.56,2.54 35.56,1.27 3.81,1.27 1.27,3.81 1.27,38.1 2.54,39.37 2.54,45.72 2.54,57.15 1.27,58.42 1.27,92.71 2.54,93.98
RSENSE  (via drill 0.2 layers 1-2)  (4 unrouted)
  Top 0.152: v33.02,25.65 32.89,25.65 32.26,25.02 U2.A4 | v26.29,31.75 25.91,32.13 25.91,32.51 U2.F10 | U2.G7 24.64,28.83 24.62,28.83 | 23.37,30.1 U2.H8 23.37,30.1
  Route2 0.152: v33.02,25.65 32.38,25.65 v26.29,31.75
  pour Top (isolate 0.254): 17.75,25.62 17.75,28 21.5,28 21.5,29.25 22.75,29.25 22.75,38.62 26.62,38.62 26.5,32 25.19,32 25.19,25.62
SETFREQ
  Top 0.152: 32,36.07 31.62,35.69 31.62,30.73 30.99,30.1 U2.B8 | 32,36.07 34.67,36.07 34.67,34.67 R4.1 | 32,36.07 32,38.35 24.38,38.35 24,37.97 24,31.88 R3.2
SGND  (via drill 0.2)
  Top 0.152: U2.A7 32.26,28.83 34.29,28.83 34.29,28.96 R2.1 34.42,29.08 34.42,30.23 | 34.42,30.23 34.42,32.38 34.67,32.64 R4.2 | 34.42,30.23 36.83,30.23 | 36.83,30.23 v41.78,30.23 | J5.9 55.24,20.57 54.23,20.57 v53.21,19.56 53.09,19.43 53.09,18.67 50.67,18.67 J5.3 50.55,18.54 50.55,18.41 48.64,18.41 47.75,17.53 47.75,15.88 45.09,15.88 J6.9 44.96,15.75 44.07,15.75 42.29,13.97 42.29,13.84 40.39,13.84 J6.3 40.26,13.84 39.62,13.84 36.83,16.64 36.83,30.23 | J3.1 81.03,82.8 81.03,78.61 84.33,75.31 J7.2 84.33,75.18 80.9,71.75 80.9,56.9 78.61,54.61 v78.61,35.81 78.49,35.69 78.49,14.1 v76.2,11.81
  Bottom 0.152: v41.78,30.23 41.78,31.88 OK3.15 | 69.34,12.95 69.72,13.34 OK2.4 69.34,12.95 | 69.34,12.95 68.2,11.81 66.17,11.81 64.64,13.34 OK2.2 64.52,13.34 62.99,11.81 60.96,11.81 v53.21,19.56 | 74.68,13.34 73.15,11.81 70.48,11.81 69.34,12.95 | 74.68,13.34 v76.2,11.81 78.23,11.81 79.76,13.34 OK2.8 | 74.68,13.34 OK2.6 | 70.36,37.08 70.61,37.34 OK1.4 70.36,37.08 | 70.36,37.08 69.09,35.81 67.06,35.81 65.53,37.34 OK1.2 | 75.56,37.34 74.04,35.81 71.63,35.81 70.36,37.08 | 75.56,37.34 77.09,35.81 v78.61,35.81 79.12,35.81 80.64,37.34 OK1.8 | 75.56,37.34 OK1.6
SW1
  pour Top (isolate 0.254): 22.62,25.5 3,25.5 3,25.38 3,12.62 22.62,12.62
SW2  (via drill 0.2)  (1 unrouted)
  other vias: 17.45,30.66 18.92,30.66 20.22,30.68 20.09,29.41 18.92,29.41 17.35,29.44
  pour Top (isolate 0.254): 17.5,25.62 17.5,28.25 21.25,28.25 21.25,29.5 22.62,29.5 22.62,31.88 3,31.88 3,25.62
  cutout Bottom (isolate 0.254): 13.94,31.81 22.62,31.81 22.62,29.5 21.25,29.5 21.25,28.25 2.94,28.19 2.94,31.75
SW3V  (via drill 0.2)
  Top 0.152: v24.26,43.69 63.63,83.06 63.63,83.57 64.39,84.33 78.74,84.33 | 78.74,84.33 87.38,84.33 87.38,54.61 85.34,52.58 TP1.1 85.22,52.58 85.22,53.47 v80.26,53.47 | 78.74,84.33 v78.74,66.42
  Bottom 0.152: v24.26,43.69 23.62,43.05 12.32,43.05 12.32,38.48 R33.1 | v80.26,53.47 78.74,53.47 U1.47 | v78.74,66.42 78.74,65.53 U1.17
SW3V_GND  (via drill 0.2)
  Top 0.152: v79.25,51.05 79.63,51.44 79.63,53.72 82.42,56.52 85.22,56.52 TP2.1 85.34,56.64 87,58.29 87,77.72 84.45,80.26 J7.1
  Bottom 0.152: v79.25,51.05 77.6,51.05 75.56,53.09 70.61,53.09 U1.48
SW_P18H1  (via drill 0.2 layers 15-16)
  Route15 0.152: v70.23,47.88 70.36,48.01 70.36,50.8 76.96,57.4 76.96,57.78 v77.22,58.04
  Bottom 0.152: v70.23,47.88 66.42,44.07 R9.2 | v77.22,58.04 77.47,58.29 78.61,58.29 U1.35
SW_P18H2
  Bottom 0.152: R10.2 72.77,44.32 70.87,46.23 70.87,50.67 69.34,50.67 68.33,51.69 68.33,58.67 70.48,58.67 U1.34
SW_P18H3  (via drill 0.2)
  Top 0.152: v73.53,21.59 73.41,21.72 73.41,56.52 v75.44,58.55
  Bottom 0.152: v73.53,21.59 71.5,19.56 R11.2 | v75.44,58.55 75.95,59.05 78.61,59.05 U1.33
SW_P18H4  (via drill 0.2)
  Top 0.152: v77.09,20.19 76.96,20.32 76.96,57.91 75.69,59.18 v72.14,59.18
  Bottom 0.152: v77.09,20.19 77.85,20.19 78.36,19.68 R12.2 | v72.14,59.18 71.88,59.44 70.61,59.44 U1.32
SW_P18L1  (via drill 0.2)
  Top 0.152: v63.5,42.42 65.91,44.83 65.91,54.74 69.72,58.55 v74.55,58.55
  Bottom 0.152: v63.5,42.42 63.5,41.02 R5.2 | v74.55,58.55 76.33,56.77 78.61,56.77 U1.39
SW_P18L2  (via drill 0.2)
  Top 0.152: v70.61,42.67 71.75,43.81 71.75,54.1 v68.96,56.9
  Bottom 0.152: v70.61,42.67 70.61,41.27 R6.2 | v68.96,56.9 69.09,57.02 70.48,57.02 U1.38
SW_P18L3  (via drill 0.2)
  Top 0.152: v67.94,16.89 76.33,16.89 v76.33,57.66
  Bottom 0.152: v67.94,16.89 66.55,16.89 R7.2 | v76.33,57.66 76.58,57.4 78.61,57.4 U1.37
SW_P18L4  (via drill 0.2)
  Top 0.152: v72.9,18.16 72.39,18.67 v72.39,57.28
  Bottom 0.152: v72.9,18.16 72.9,16.76 R8.2 | v72.39,57.28 71.75,57.91 70.61,57.91 U1.36
TP_CH1  (via drill 0.2)
  Top 0.152: v81.53,59.94 85.09,63.5 85.09,65.41 TP4.1 | v41.91,43.81 58.17,60.07 v80.26,60.07
  Bottom 0.152: v81.53,59.94 80.26,59.94 | 80.26,59.94 78.74,59.94 U1.31 | v41.91,43.81 41.91,42.16 OK3.2 | 80.26,59.94 v80.26,60.07
V+  (via drill 0.2)
  Top 0.152: v44.96,3.94 69.22,3.94 78.87,13.59 78.87,21.72 80.26,23.11 J4.2
  Bottom 0.152: 10.67,2.41 11.05,2.41 U4.19 | 10.67,2.41 9.91,2.41 U4.20 | 13.59,3.56 13.59,2.54 U4.17 | 13.59,3.56 11.81,3.56 10.67,2.41 | 16.13,3.56 16.13,2.54 U4.15 | 13.59,3.56 16.13,3.56 | U3.20 23.5,2.67 24.64,2.67 U3.19 24.77,2.54 24.77,0.89 | 20.19,0.89 18.8,0.89 18.8,2.41 U4.13 18.67,2.54 18.67,2.92 17.4,4.19 16.76,4.19 16.13,3.56 | 20.19,0.89 21.21,1.91 21.21,2.41 U4.11 | 27.3,0.89 27.3,2.54 U3.17 | 20.19,0.89 24.77,0.89 | 24.77,0.89 27.3,0.89 | 27.3,0.89 28.07,0.89 28.83,1.65 29.72,1.65 29.72,2.54 U3.15 29.84,2.67 29.84,3.05 30.48,3.68 32.26,3.68 | 32.26,3.68 32.26,2.67 U3.13 | 34.8,3.68 34.8,2.67 U3.11 | 32.26,3.68 34.8,3.68 | v44.96,3.94 44.7,3.68 34.8,3.68
VBATT
  Top 0.152: J2.98 69.85,89.41 | 69.85,89.41 J2.97 | L2.1 8.51,47.88 5.71,50.67 5.71,54.86 C1.A1 5.71,54.99 5.71,63.25 14.1,63.25 27.81,76.96 27.81,89.41 69.85,89.41
VBATT_GND
  Top 0.152: J2.83 J2.81 48.13,86.87 48.13,82.68 17.4,51.94 | 17.4,51.94 14.48,54.86 C1.K1 14.35,54.99 14.35,55.88 8.13,62.1 J1.1 | 17.4,51.94 23.62,45.72 23.62,41.4 24,41.02 C2.2 | J2.84 J2.82
  Bottom 0.305: J2.84 J2.83
VIN  (via drill 0.2)
  other vias: 17.35,33.25 17.22,34.44 18.9,36.02 20.17,36.04 21.49,36.04 21.41,34.44 20.14,34.52 18.9,34.49 18.9,33.22 20.19,33.25 21.44,33.22
  pour Top (isolate 0.254): 22.62,32 22.62,43.44 2.88,43.38 2.88,42.88 3,42.88 3,32
  cutout Bottom (isolate 0.254): 22.62,32.06 22.62,36.19 22.62,41.5 22.62,43.44 2.88,43.38 2.88,31.81 5.69,31.81 22.62,31.94
VOUT
  Top 0.152: 23.37,21.21 23.37,22.35 U2.H2 23.37,22.48 | 23.37,21.21 24.51,21.21 U2.G1 24.64,21.21 25.78,21.21 U2.F1 25.91,21.21 27.05,21.21 U2.E1 27.18,21.08 27.3,20.95 27.3,17.53 28.57,16.26 28.57,7.87 | 23.37,21.21 U2.VOUT | 23.37,22.48 24.51,22.48 U2.G2 24.64,22.48 25.78,22.48 U2.F2 25.91,22.48 27.05,22.48 U2.E2 | 23.37,22.48 23.37,23.62 U2.H3 23.37,23.75 | 23.37,23.75 24.51,23.75 U2.G3 24.64,23.75 25.78,23.75 U2.F3 | 23.37,23.75 23.37,24.89 U2.H4 23.37,25.02 24.51,25.02 U2.G4 24.64,25.02 25.78,25.02 U2.F4 | L3.1 28.45,7.24 29.59,6.1 29.59,3.17 C4.1 | 28.57,7.87 28.45,7.87 28.45,7.37 L3.1 | 28.57,7.87 30.86,7.87 31.5,7.24 C3.1 | 28.57,7.87 L3.1
VOUTA  (via drill 0.2)  (1 unrouted)
  Top 0.152: Q6.D 11.43,3.05 11.56,3.17 11.56,8.38 11.43,8.51 Q2.D 11.43,8.64 13.21,10.41 13.21,11.81 13.46,12.06 15.24,12.06 15.24,11.68 | 25.02,5.46 R31.2 | 25.02,5.46 25.02,3.94 L3.2 | Q4.D 17.78,2.92 15.37,5.33 R32.2 15.37,5.46 16.38,6.48 16.38,10.03 | 22.99,12.62 22.99,12.19 21.84,11.05 R29.2 21.72,11.05 21.08,11.68 15.24,11.68 | 16.38,10.03 17.65,8.76 17.65,8.51 Q1.D | 16.38,10.03 15.24,11.18 R30.2 15.24,11.3 15.24,11.68 | 25.02,5.46 25.65,5.46 25.65,12.62 | 22.86,19.56 v22.1,20.32 | v65.53,23.75 58.29,16.51 58.29,10.79 55.88,8.38 45.21,8.38 45.09,8.51 35.94,8.51 35.94,8.89 35.56,9.27 29.21,9.27 29.21,12.62 | 25.65,14.99 C5.A1 25.65,14.99
  Bottom 0.152: R13.1 64.14,23.75 v65.53,23.75 66.8,23.75 R17.1 66.93,23.88 67.06,24 70.74,24 R15.1 70.87,24.13 73.91,24.13 R14.1 74.04,24.26 76.45,24.26 | 76.45,24.26 77.22,24.26 77.34,24.38 R16.1 | 76.45,24.26 76.45,22.61 77.22,21.84 80.26,21.84 80.26,18.16 J4.1 | 26.54,29.84 26.54,32.64 26.67,32.64 R19.1 26.8,32.77 26.92,32.77 26.92,36.58 R18.1 | 26.54,29.84 26.54,28.83 R20.1 | 26.54,29.84 24.64,29.84 22.1,27.3 v22.1,20.32
  pour Top (isolate 0.254): 22.81,25.44 22.81,12.62 29.25,12.62 29.25,18.19 27.69,19.38 27.69,22.94 26.44,22.94 26.44,25.44